# EAGLE design pcb (EAGLE 6.4)
CHECKED: ctstoner; COMPANY: Michigan Technological Univ.; DATE: 4/20/2013; DRAWN: mjbeals; DRGNO: 1; REV: A
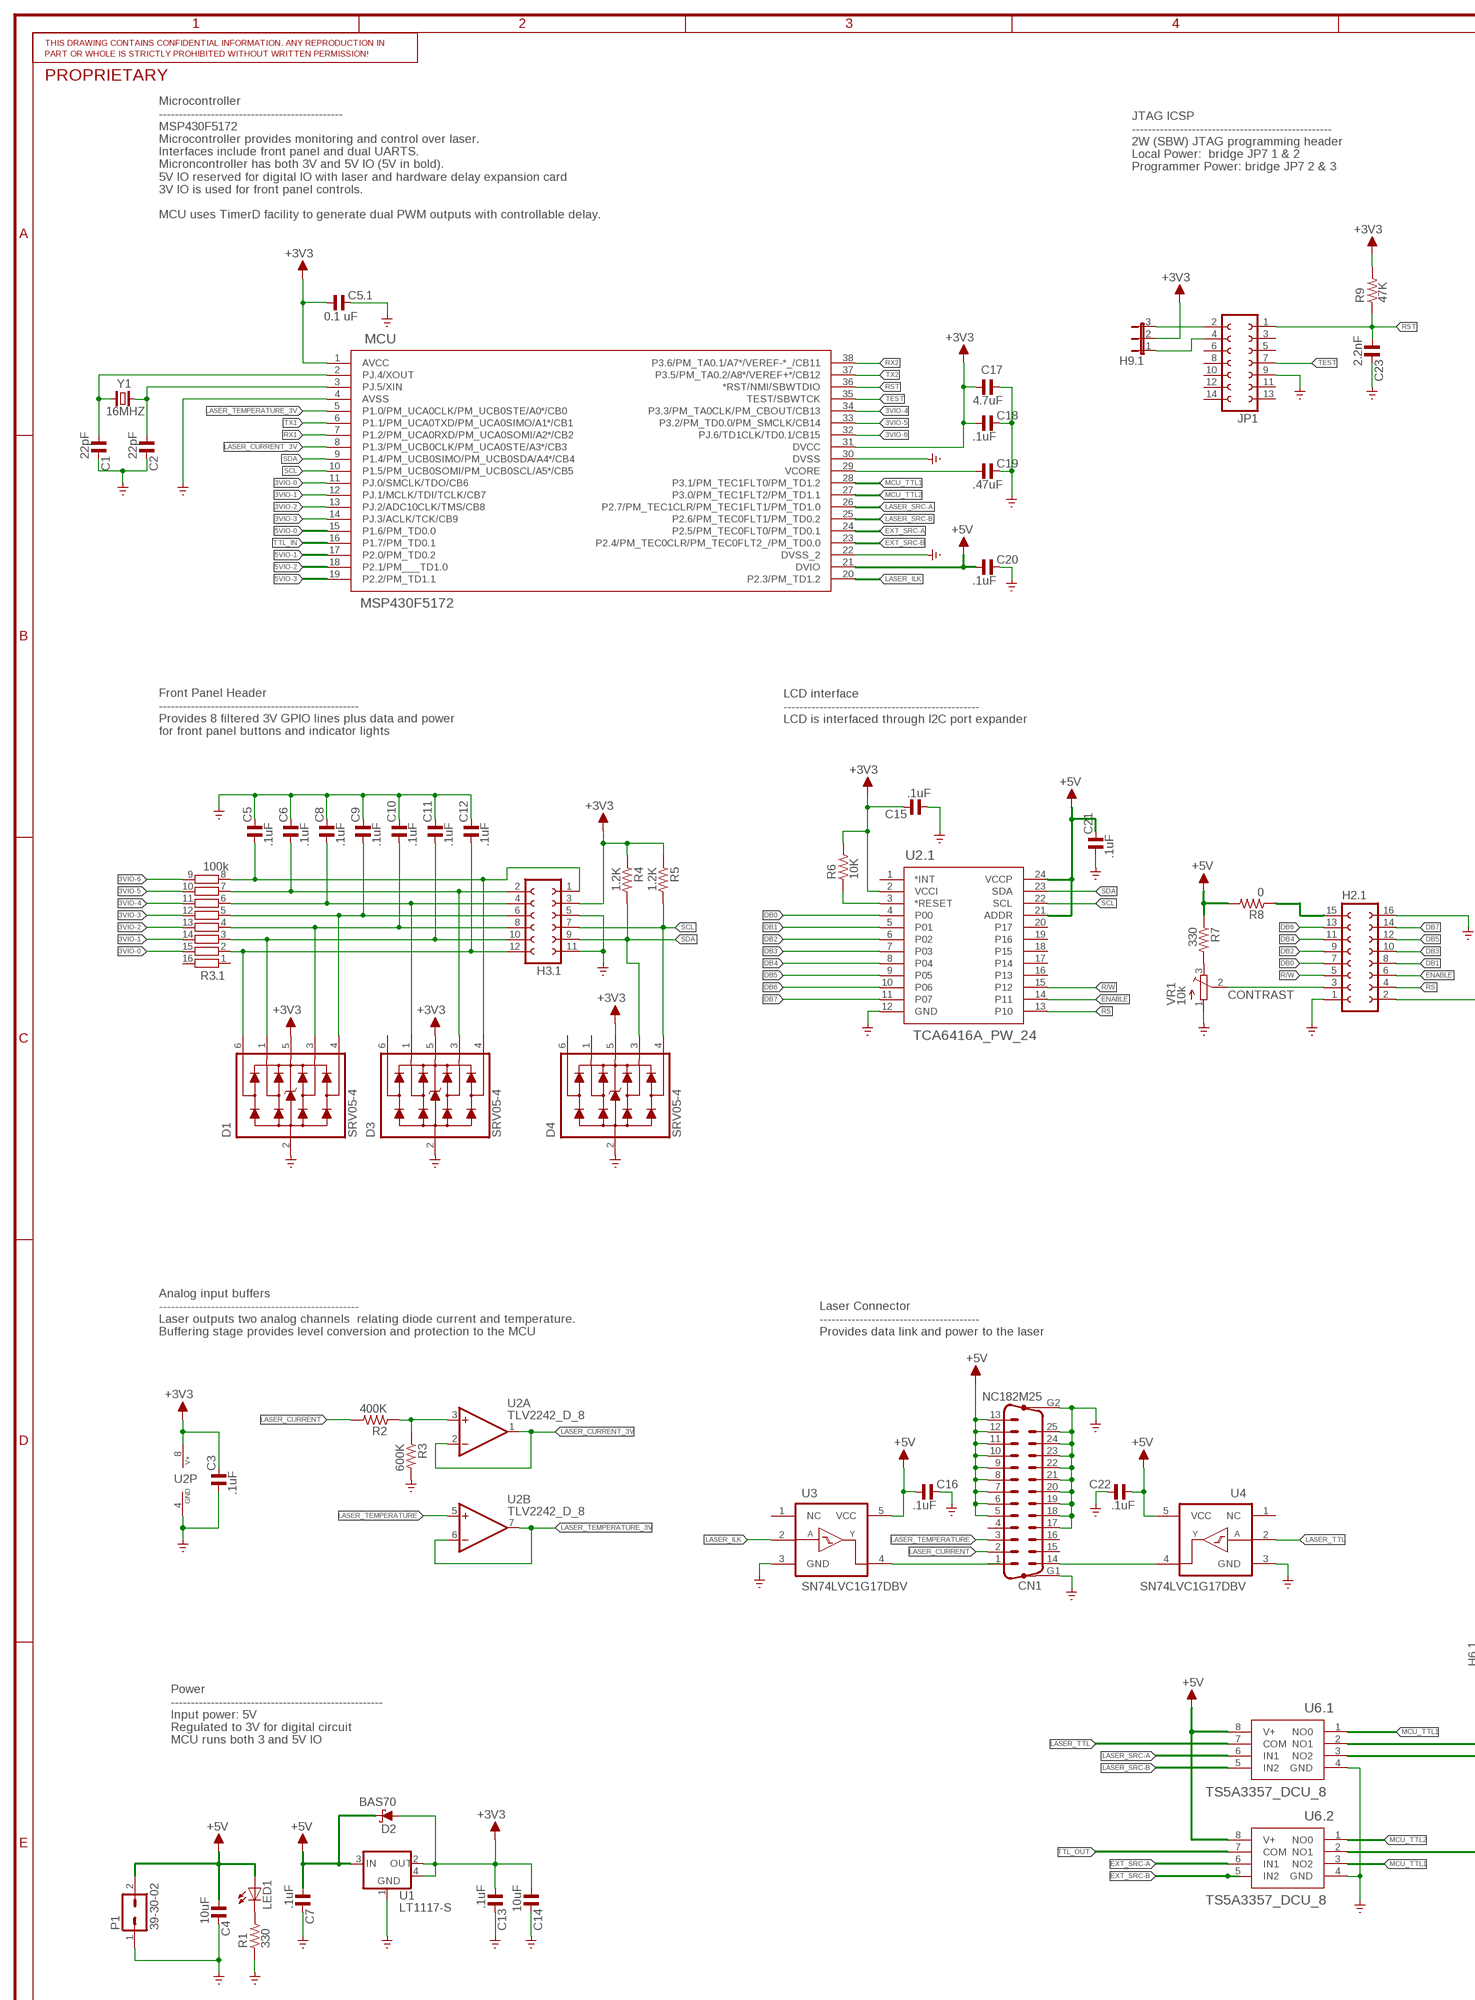
[diagram p0: schematic, sheet 1, part 1 of 3]
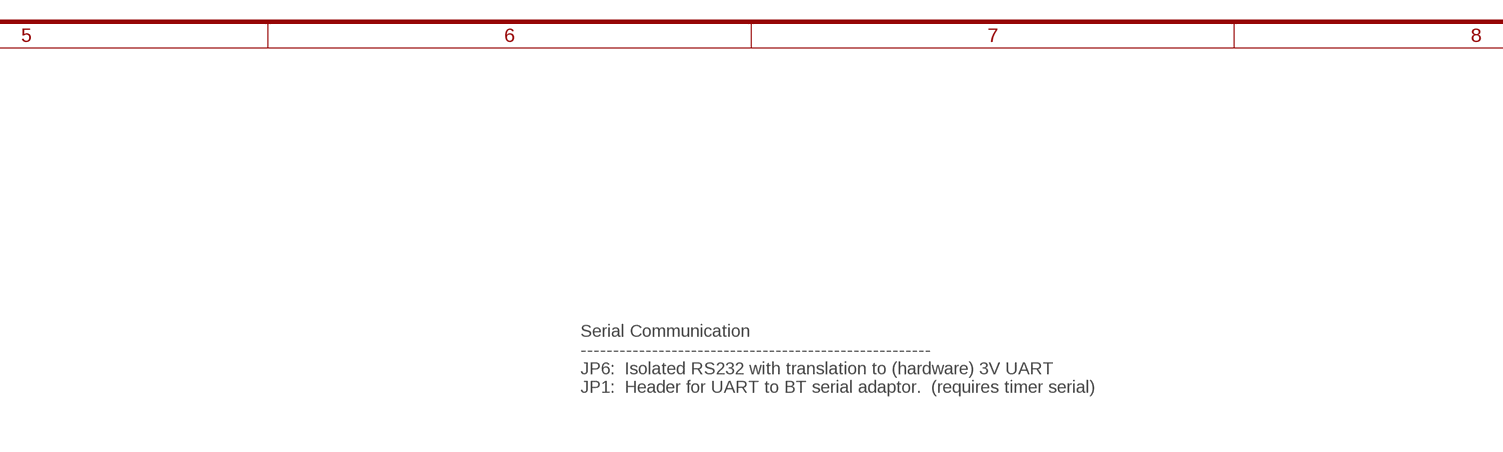
[diagram p1: schematic, sheet 1, part 2 of 3]
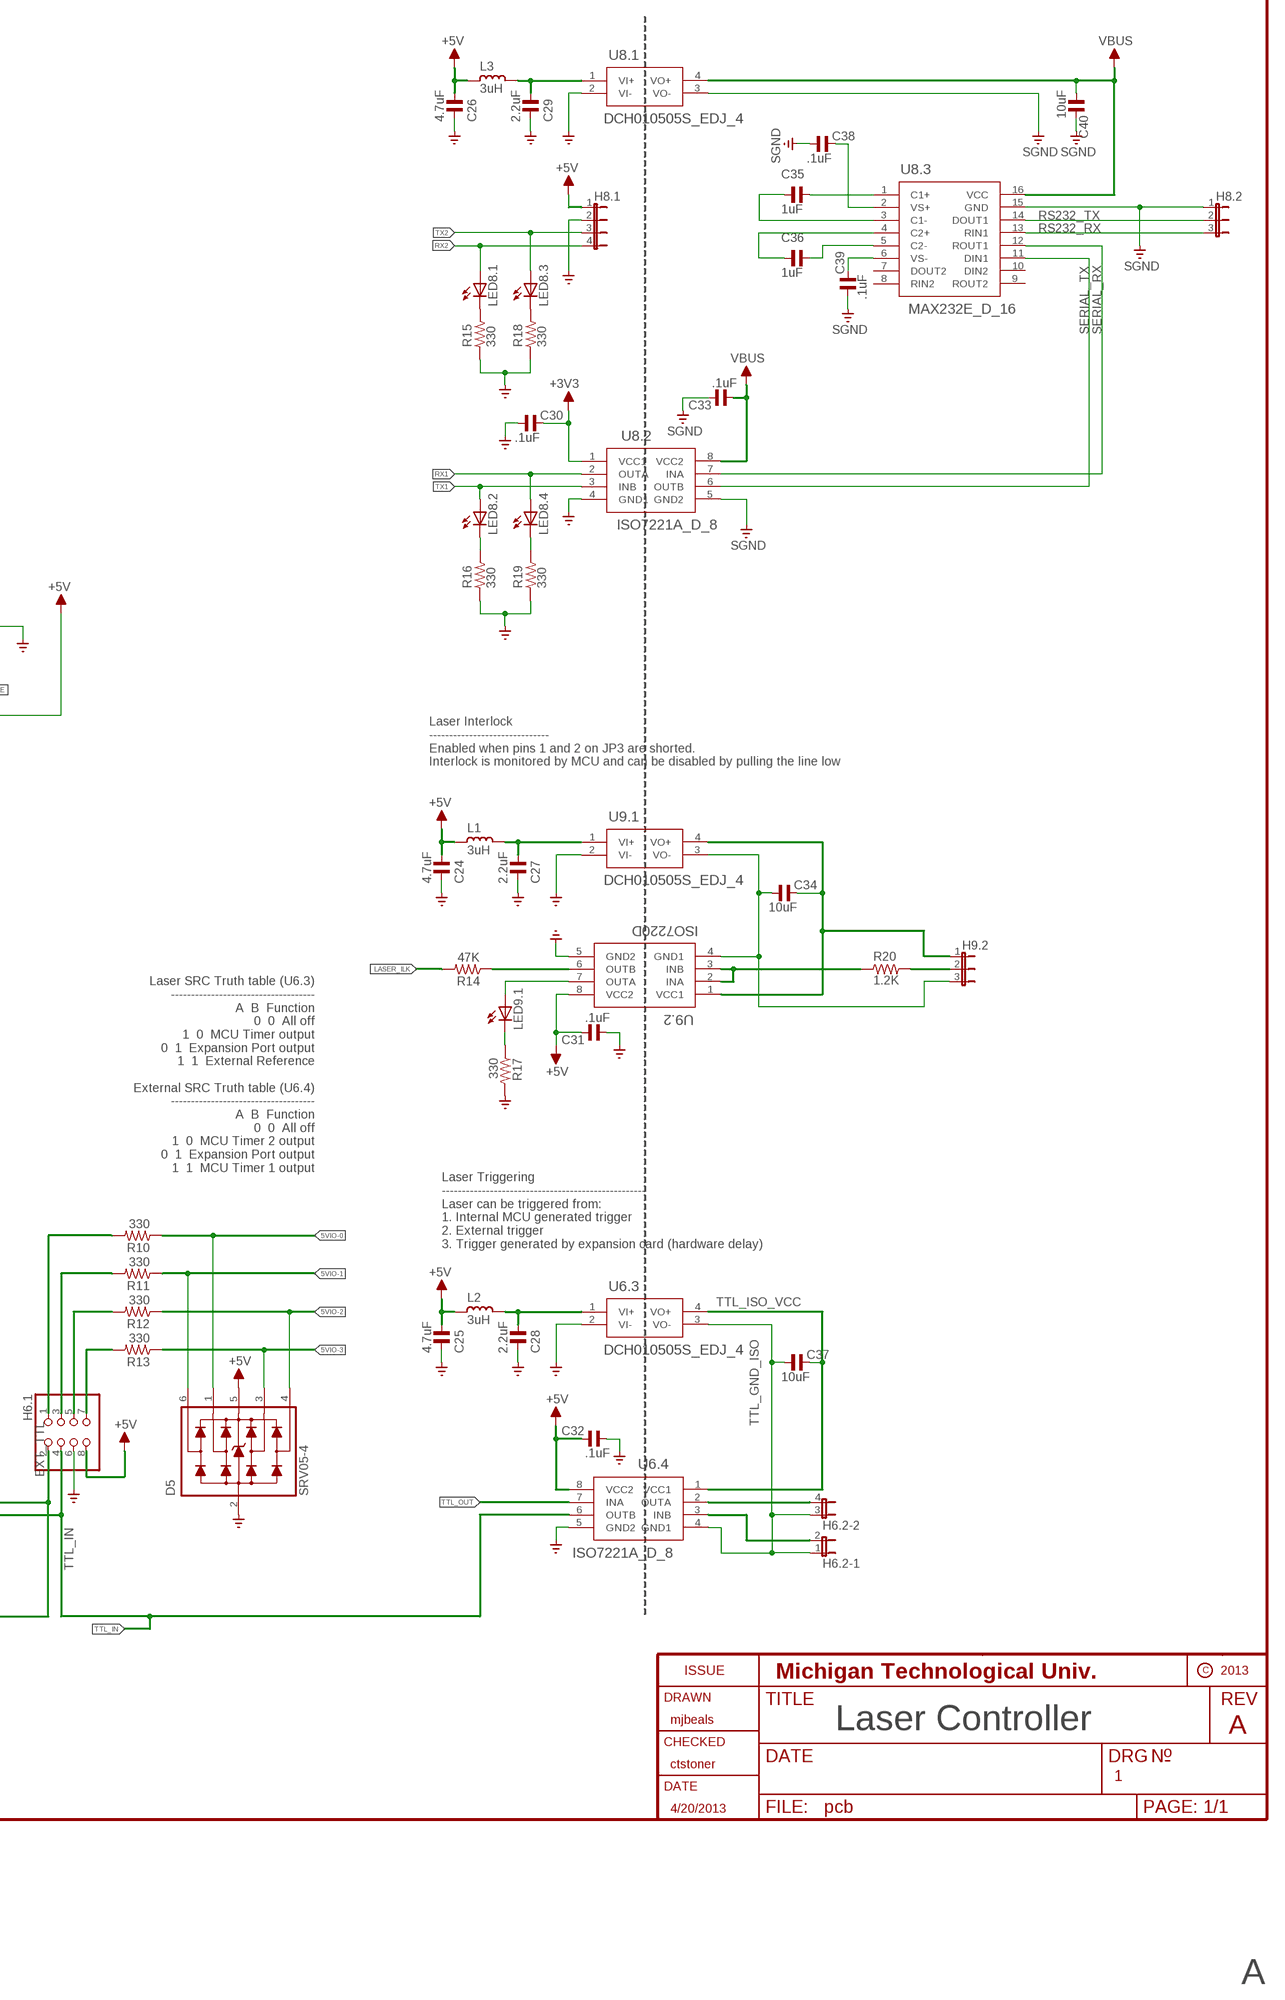
[diagram p2: schematic, sheet 1, part 3 of 3]

## Parts
C1  22pF  C_0603  [C0603]
C2  22pF  C_0603  [C0603]
C3  .1uF  C_0603  [C0603]
C4  10uF  C_0603  [C0603]
C5  .1uF  C_0603  [C0603]
C5.1  0.1 uF  C_0603  [C0603]
C6  .1uF  C_0603  [C0603]
C7  .1uF  C_0603  [C0603]
C8  .1uF  C_0603  [C0603]
C9  .1uF  C_0603  [C0603]
C10  .1uF  C_0603  [C0603]
C11  .1uF  C_0603  [C0603]
C12  .1uF  C_0603  [C0603]
C13  .1uF  C_0603  [C0603]
C14  10uF  C_0603  [C0603]
C15  .1uF  C_0603  [C0603]
C16  .1uF  C_0603  [C0603]
C17  4.7uF  C_0603  [C0603]
C18  .1uF  C_0603  [C0603]
C19  .47uF  C_0603  [C0603]
C20  .1uF  C_0603  [C0603]
C21  .1uF  C_0603  [C0603]
C22  .1uF  C_0603  [C0603]
C23  2.2nF  C_0603  [C0603]
C24  4.7uF  C_0603  [C0603]
C25  4.7uF  C_0603  [C0603]
C26  4.7uF  C_0603  [C0603]
C27  2.2uF  C_0603  [C0603]
C28  2.2uF  C_0603  [C0603]
C29  2.2uF  C_0603  [C0603]
C30  .1uF  C_0603  [C0603]
C31  .1uF  C_0603  [C0603]
C32  .1uF  C_0603  [C0603]
C33  .1uF  C_0603  [C0603]
C34  10uF  C_0603  [C0603]
C35  1uF  C_0603  [C0603]
C36  1uF  C_0603  [C0603]
C37  10uF  C_0603  [C0603]
C38  .1uF  C_0603  [C0603]
C39  .1uF  C_0603  [C0603]
C40  10uF  C_0603  [C0603]
CN1  NC182M25  [NC182M25]
D1  SRV05-4  [SOT23-6L]
D2  BAS70  [SOT23]
D3  SRV05-4  [SOT23-6L]
D4  SRV05-4  [SOT23-6L]
D5  SRV05-4  [SOT23-6L]
H2.1  FE08-2  [FE08-2]
H3.1  FE06-2  [FE06-2]
H6.1  PINHD-2X4  [2X04]
H6.2  JP2QE  [JP2Q]
H8.1  JP4E  [JP4]
H8.2  JP2E  [JP2]
H9.1  JP2E  [JP2]
H9.2  JP2E  [JP2]
JP1  FE07-2  [FE07-2]
L1  3uH  L_0805  [L0805]
L2  3uH  L_0805  [L0805]
L3  3uH  L_0805  [L0805]
LED1  LEDSMT1206  [1206]
LED8.1  LEDSMT1206  [1206]
LED8.2  LEDSMT1206  [1206]
LED8.3  LEDSMT1206  [1206]
LED8.4  LEDSMT1206  [1206]
LED9.1  LEDSMT1206  [1206]
MCU  MSP430F5172  MSP430F5172_DA_38  [DA38]
P1  39-30-02  [39-30-?02?]
R1  330  R_0603  [R0603]
R2  400K  R_0603  [R0603]
R3  600K  R_0603  [R0603]
R3.1  100k  2QSP16-8  [2QSP16]
R4  1.2K  R_0603  [R0603]
R5  1.2K  R_0603  [R0603]
R6  10K  R_0603  [R0603]
R7  330  R_0603  [R0603]
R8  0  R_0603  [R0603]
R9  47K  R_0603  [R0603]
R10  330  R_0603  [R0603]
R11  330  R_0603  [R0603]
R12  330  R_0603  [R0603]
R13  330  R_0603  [R0603]
R14  47K  R_0603  [R0603]
R15  330  R_0603  [R0603]
R16  330  R_0603  [R0603]
R17  330  R_0603  [R0603]
R18  330  R_0603  [R0603]
R19  330  R_0603  [R0603]
R20  1.2K  R_0603  [R0603]
U1  LT1117-S  [SOT223]
U2  TLV2242_D_8  LMV358D  [SO08]
U2.1  TCA6416A_PW_24  [PW24]
U3  SN74LVC1G17DBV  [SOT23-5]
U4  SN74LVC1G17DBV  [SOT23-5]
U6.1  TS5A3357_DCU_8  [DCU8]
U6.2  TS5A3357_DCU_8  [DCU8]
U6.3  DCH010505S_EDJ_4  [EDJ4]
U6.4  ISO7221A_D_8  [D8]
U8.1  DCH010505S_EDJ_4  [EDJ4]
U8.2  ISO7221A_D_8  [D8]
U8.3  MAX232E_D_16  [D16]
U9.1  DCH010505S_EDJ_4  [EDJ4]
U9.2  ISO7220D  ISO7420_D_8  [D8]
VR1  10k  TRIMPOTTC33X  [TC33X]
Y1  16MHZ  CRYTALHC49S  [HC49/S]

## Nets
3VIO-0: MCU.11(PJ.0/SMCLK/TDO/CB6) R3.1.15
3VIO-0H: C5.1 D3.4 H3.1.1 R3.1.8
3VIO-1: MCU.12(PJ.1/MCLK/TDI/TCLK/CB7) R3.1.14
3VIO-1H: C6.1 D3.3 H3.1.2 R3.1.7
3VIO-2: MCU.13(PJ.2/ADC10CLK/TMS/CB8) R3.1.13
3VIO-2H: C8.1 D3.1 H3.1.4 R3.1.6
3VIO-3: MCU.14(PJ.3/ACLK/TCK/CB9) R3.1.12
3VIO-3H: C9.1 D1.4 H3.1.6 R3.1.5
3VIO-4: MCU.34(P3.3/PM_TA0CLK/PM_CBOUT/CB13) R3.1.11
3VIO-4H: C10.1 D1.3 H3.1.8 R3.1.4
3VIO-5: MCU.33(P3.2/PM_TD0.0/PM_SMCLK/CB14) R3.1.10
3VIO-5H: C11.1 D1.1 H3.1.10 R3.1.3
3VIO-6: MCU.32(PJ.6/TD1CLK/TD0.1/CB15) R3.1.9
3VIO-6H: C12.1 D1.6 H3.1.12 R3.1.2
5VIO-0: D5.1 MCU.15(P1.6/PM_TD0.0) R10.1
5VIO-1: D5.6 MCU.17(P2.0/PM_TD0.2) R11.1
5VIO-2: D5.4 MCU.18(P2.1/PM___TD1.0) R12.1
5VIO-3: D5.3 MCU.19(P2.2/PM_TD1.1) R13.1
+3V3: C3.2 C5.1.1 C13.1 C14.1 C15.2 C17.1 C18.1 C30.2 D1.5 D2.1(A) D3.5 D4.5 H3.1.3 H9.1.2 MCU.1(AVCC) MCU.31(DVCC) R4.1 R5.1 R6.2 R9.2 U1.2(OUT) U1.4(TAB) U2.1.2(VCCI) U2.8(P:V+) U8.2.1(VCC1)
+5V: C4.1 C7.1 C16.1 C20.1 C21.2 C22.1 C24.1 C25.1 C26.1 C31.2 C32.2 CN1.5 CN1.6 CN1.7 CN1.8 CN1.9 CN1.10 CN1.11 CN1.12 CN1.13 D2.3(C) D5.5 H2.1.2 H6.1.8 H8.1.1 L1.2 L2.2 L3.2 LED1.A MCU.21(DVIO) P1.2 R7.1 R8.2 U1.3(IN) U2.1.21(ADDR) U2.1.24(VCCP) U3.5(VCC) U4.5(VCC) U6.1.8(V+) U6.2.8(V+) U6.4.8(VCC2) U9.2.8(VCC2)
CONTRAST: H2.1.3 VR1.2(S)
DB0: H2.1.7 U2.1.4(P00)
DB1: H2.1.8 U2.1.5(P01)
DB2: H2.1.9 U2.1.6(P02)
DB3: H2.1.10 U2.1.7(P03)
DB4: H2.1.11 U2.1.8(P04)
DB5: H2.1.12 U2.1.9(P05)
DB6: H2.1.13 U2.1.10(P06)
DB7: H2.1.14 U2.1.11(P07)
ENABLE: H2.1.6 U2.1.14(P11)
EXT_SRC-A: MCU.24(P2.5/PM_TEC0FLT0/PM_TD0.1) U6.2.6(IN1)
EXT_SRC-B: MCU.23(P2.4/PM_TEC0CLR/PM_TEC0FLT2_/PM_TD0.0) U6.2.5(IN2)
EXT_TTL: H6.1.2 U6.1.2(NO1) U6.2.2(NO1)
GND: C1.2 C2.2 C3.1 C4.2 C5.1.2 C5.2 C6.2 C7.2 C8.2 C9.2 C10.2 C11.2 C12.2 C13.2 C14.2 C15.1 C16.2 C17.2 C18.2 C19.2 C20.2 C21.1 C22.2 C23.2 C24.2 C25.2 C26.2 C27.2 C28.2 C29.2 C30.1 C31.1 C32.1 CN1.17 CN1.18 CN1.19 CN1.20 CN1.21 CN1.22 CN1.23 CN1.24 CN1.25 CN1.G1 CN1.G2 D1.2 D3.2 D4.2 D5.2 H2.1.1 H2.1.16 H3.1.5 H3.1.11 H6.1.6 H8.1.2 JP1.9 MCU.4(AVSS) MCU.22(DVSS_2) MCU.30(DVSS) P1.1 R1.1 R3.2 R15.1 R16.1 R17.2 R18.1 R19.1 U1.1(GND) U2.1.12(GND) U2.4(P:GND) U3.3(GND) U4.3(GND) U6.1.4(GND) U6.2.4(GND) U6.3.2(VI-) U6.4.5(GND2) U8.1.2(VI-) U8.2.4(GND1) U9.1.2(VI-) U9.2.5(GND2) VR1.1(A)
LASER_CURRENT: CN1.2 R2.2
LASER_CURRENT_3V: MCU.8(P1.3/PM_UCB0CLK/PM_UCA0STE/A3*/CB3) U2.1(A:OUT) U2.2(A:-IN)
LASER_ILK: MCU.20(P2.3/PM_TD1.2) R14.2 U3.2(A)
LASER_ILK_HIGH: R14.1 U9.2.6(OUTB)
LASER_SRC-A: MCU.26(P2.7/PM_TEC1CLR/PM_TEC1FLT1/PM_TD1.0) U6.1.6(IN1)
LASER_SRC-B: MCU.25(P2.6/PM_TEC0FLT1/PM_TD0.2) U6.1.5(IN2)
LASER_TEMPERATURE: CN1.3 U2.5(B:+IN)
LASER_TEMPERATURE_3V: MCU.5(P1.0/PM_UCA0CLK/PM_UCB0STE/A0*/CB0) U2.6(B:-IN) U2.7(B:OUT)
LASER_TTL: U4.2(A) U6.1.7(COM)
MCU_TTL1: MCU.28(P3.1/PM_TEC1FLT0/PM_TD1.2) U6.1.1(NO0) U6.2.3(NO2)
MCU_TTL2: MCU.27(P3.0/PM_TEC1FLT2/PM_TD1.1) U6.2.1(NO0)
N$1: C36.1 U8.3.4(C2+)
N$2: C36.2 U8.3.5(C2-)
N$3: C35.1 U8.3.3(C1-)
N$4: C35.2 U8.3.1(C1+)
N$5: C39.2 U8.3.6(VS-)
N$6: C38.2 U8.3.2(VS+)
N$8: LED9.1.A U9.2.7(OUTA)
N$9: C27.1 L1.1 U9.1.1(VI+)
N$10: CN1.14 U4.4(Y)
N$11: H6.2.2 U6.4.3(INB)
N$12: CN1.1 U3.4(Y)
N$13: H9.1.1 JP1.4
N$14: H9.2.2 R20.2
N$15: R6.1 U2.1.3(*RESET)
N$16: H9.1.3 JP1.2
N$17: H6.1.1 R10.2
N$18: R2.1 R3.1 U2.3(A:+IN)
N$19: R20.1 U9.2.2(INA) U9.2.3(INB)
N$20: LED1.C R1.2
N$21: C1.1 MCU.2(PJ.4/XOUT) Y1.2
N$22: C2.1 MCU.3(PJ.5/XIN) Y1.1
N$23: LED8.2.C R16.2
N$24: C19.1 MCU.29(VCORE)
N$25: LED8.4.C R19.2
N$26: LED8.1.C R15.2
N$27: C34.2 H9.2.1 U9.1.4(VO+) U9.2.1(VCC1)
N$28: C34.1 H9.2.3 U9.1.3(VO-) U9.2.4(GND1)
N$29: LED8.3.C R18.2
N$30: LED9.1.C R17.1
N$31: H6.1.3 R11.2
N$32: C28.1 L2.1 U6.3.1(VI+)
N$33: C29.1 L3.1 U8.1.1(VI+)
N$34: H6.1.5 R12.2
N$35: H6.1.7 R13.2
N$39: R7.2 VR1.3(E)
N$41: H2.1.15 R8.1
R/W: H2.1.5 U2.1.15(P12)
RS: H2.1.4 U2.1.13(P10)
RS232_RX: H8.2.3 U8.3.13(RIN1)
RS232_TX: H8.2.2 U8.3.14(DOUT1)
RST: C23.1 JP1.1 MCU.36(*RST/NMI/SBWTDIO) R9.1
RX1: LED8.4.A MCU.7(P1.2/PM_UCA0RXD/PM_UCA0SOMI/A2*/CB2) U8.2.2(OUTA)
RX2: H8.1.4 LED8.1.A MCU.38(P3.6/PM_TA0.1/A7*/VEREF-*_/CB11)
SCL: D4.4 H3.1.7 MCU.10(P1.5/PM_UCB0SOMI/PM_UCB0SCL/A5*/CB5) R5.2 U2.1.22(SCL)
SDA: D4.3 H3.1.9 MCU.9(P1.4/PM_UCB0SIMO/PM_UCB0SDA/A4*/CB4) R4.2 U2.1.23(SDA)
SERIAL_RX: U8.2.7(INA) U8.3.12(ROUT1)
SERIAL_TX: U8.2.6(OUTB) U8.3.11(DIN1)
SGND: C33.2 C38.1 C39.1 C40.2 H8.2.1 U8.1.3(VO-) U8.2.5(GND2) U8.3.15(GND)
TEST: JP1.7 MCU.35(TEST/SBWTCK)
TTL_GND_ISO: C37.1 H6.2.1 H6.2.3 U6.3.3(VO-) U6.4.4(GND1)
TTL_IN: H6.1.4 MCU.16(P1.7/PM_TD0.1) U6.1.3(NO2) U6.4.6(OUTB)
TTL_ISO_VCC: C37.2 U6.3.4(VO+) U6.4.1(VCC1)
TTL_OUT: U6.2.7(COM) U6.4.7(INA)
TTL_OUT_ISO: H6.2.4 U6.4.2(OUTA)
TX1: LED8.2.A MCU.6(P1.1/PM_UCA0TXD/PM_UCA0SIMO/A1*/CB1) U8.2.3(INB)
TX2: H8.1.3 LED8.3.A MCU.37(P3.5/PM_TA0.2/A8*/VEREF+*/CB12)
VBUS: C33.1 C40.1 U8.1.4(VO+) U8.2.8(VCC2) U8.3.16(VCC)
Unconnected: CN1.4 CN1.15 CN1.16 D3.6 D4.1 D4.6 JP1.3 JP1.5 JP1.6 JP1.8 JP1.10 JP1.11 JP1.12 JP1.13 JP1.14 R3.1.1 R3.1.16 U2.1.1(*INT) U2.1.16(P13) U2.1.17(P14) U2.1.18(P15) U2.1.19(P16) U2.1.20(P17) U3.1(NC) U4.1(NC) U8.3.7(DOUT2) U8.3.8(RIN2) U8.3.9(ROUT2) U8.3.10(DIN2)

## Notes on the sheet
- JTAG ICSP
  --------------------------------------------------
  2W (SBW) JTAG programming header
  Local Power:  bridge JP7 1 & 2
  Programmer Power: bridge JP7 2 & 3
- Microcontroller
  ----------------------------------------------
  MSP430F5172
  Microcontroller provides monitoring and control over laser.
  Interfaces include front panel and dual UARTS.
  Microncontroller has both 3V and 5V IO (5V in bold).
  5V IO reserved for digital IO with laser and hardware delay expansion card
  3V IO is used for front panel controls.
  
  MCU uses TimerD facility to generate dual PWM outputs with controllable delay.
- Serial Communication
  ------------------------------------------------------
  JP6:  Isolated RS232 with translation to (hardware) 3V UART
  JP1:  Header for UART to BT serial adaptor.  (requires timer serial)
- LCD interface
  -------------------------------------------------
  LCD is interfaced through I2C port expander
- Front Panel Header
  --------------------------------------------------
  Provides 8 filtered 3V GPIO lines plus data and power 
  for front panel buttons and indicator lights
- Laser Interlock
  ------------------------------
  Enabled when pins 1 and 2 on JP3 are shorted.
  Interlock is monitored by MCU and can be disabled by pulling the line low
- Analog input buffers
  --------------------------------------------------
  Laser outputs two analog channels  relating diode current and temperature.
  Buffering stage provides level conversion and protection to the MCU
- Laser Connector
  ----------------------------------------
  Provides data link and power to the laser
- Laser SRC Truth table (U6.3)
  ------------------------------------
  A  B  Function
  0  0  All off
  1  0  MCU Timer output
  0  1  Expansion Port output
  1  1  External Reference
  
  External SRC Truth table (U6.4)
  ------------------------------------
  A  B  Function
  0  0  All off
  1  0  MCU Timer 2 output
  0  1  Expansion Port output
  1  1  MCU Timer 1 output
- Laser Triggering
  ---------------------------------------------------
  Laser can be triggered from:
  1. Internal MCU generated trigger
  2. External trigger
  3. Trigger generated by expansion card (hardware delay)
- Power
  -----------------------------------------------------
  Input power: 5V
  Regulated to 3V for digital circuit
  MCU runs both 3 and 5V IO
- Laser Controller
- A

## Library data of the parts
C1-C5 C5.1 C6-C40 = rc-master-smd:C_: NON-POLARIZED CAP
CN1 = custom:NC182M25: DB25 Male
D1 D3-D5 = diode:SRV05-4: TVS Diode Array RailClamp® Low-Capacitance
D2 = diode:BAS70: Silicon Schottky Diodes General-purpose diode for high-speed switching
H2.1 = con-lsta:FE08-2: FEMALE HEADER; OC_FARNELL: unknown; OC_NEWARK: unknown
H3.1 = con-lsta:FE06-2: FEMALE HEADER; OC_FARNELL: unknown; OC_NEWARK: unknown
H6.1 = adafruit:PINHD-2X4: PIN HEADER
H6.2 = jumper:JP2QE: JUMPER
H8.1 = jumper:JP4E: JUMPER
H8.2 H9.1 H9.2 = jumper:JP2E: JUMPER
JP1 = con-lsta:FE07-2: FEMALE HEADER; OC_FARNELL: unknown; OC_NEWARK: unknown
L1-L3 = rc-master-smd:L_: INDUCTOR
LED1 LED8.1-LED8.4 LED9.1 = led:LED: LED OSRAM: - CHIPLED LG R971, LG N971, LY N971, LG Q971, LY Q971, LO R971, LY R971 LH N974, LH R974 LS Q976, LO Q976, LY Q976 LO Q996 - Hyper CHIPLED LW Q18S LB Q993, LB Q99A, LB R99A - SideLED LS A670, LO A670, LY A670, LG A670, LP A670 LB A673, LV A673, LT A673, LW A673 LH A674 LY A675 LS A676, LA A676, LO A676, LY A676, LW A676 LS A679, LY A679, LG A679 - Hyper Micro SIDELED® LS Y876, LA Y876, LO Y876, LY Y876 LT Y87S - SmartLED LW L88C, LW L88S LB L89C, LB L89S, LG L890 LS L89K, LO L89K, LY L89K LS L896, LA L896, LO L896, LY L896 - TOPLED LS T670, LO T670, LY T670, LG T670, LP T670 LSG T670, LSP T670, LSY T670, LOP T670, LYG T670 LG T671, LOG T671, LSG T671 LB T673, LV T673, LT T673, LW T673 LH T674 LS T676, LA T676, LO T676, LY T676, LB T676, LH T676, LSB T676, LW T676 LB T67C, LV T67C, LT T67C, LS T67K, LO T67K, LY T67K, LW E67C LS E67B, LA E67B, LO E67B, LY E67B, LB E67C, LV E67C, LT E67C LW T67C LS T679, LY T679, LG T679 LS T770, LO T770, LY T770, LG T770, LP T770 LB T773, LV T773, LT T773, LW T773 LH T774 LS E675, LA E675, LY E675, LS T675 LS T776, LA T776, LO T776, LY T776, LB T776 LHGB T686 LT T68C, LB T68C - Hyper Mini TOPLED® LB M676 - Mini TOPLED Santana® LG M470 LS M47K, LO M47K, LY M47K Source: http://www.osram.convergy.de LUXEON: - LUMILED® LXK2-PW12-R00, LXK2-PW12-S00, LXK2-PW14-U00, LXK2-PW14-V00 LXK2-PM12-R00, LXK2-PM12-S00, LXK2-PM14-U00 LXK2-PE12-Q00, LXK2-PE12-R00, LXK2-PE12-S00, LXK2-PE14-T00, LXK2-PE14-U00 LXK2-PB12-K00, LXK2-PB12-L00, LXK2-PB12-M00, LXK2-PB14-N00, LXK2-PB14-P00, LXK2-PB14-Q00 LXK2-PR12-L00, LXK2-PR12-M00, LXK2-PR14-Q00, LXK2-PR14-R00 LXK2-PD12-Q00, LXK2-PD12-R00, LXK2-PD12-S00 LXK2-PH12-R00, LXK2-PH12-S00 LXK2-PL12-P00, LXK2-PL12-Q00, LXK2-PL12-R00 Source: www.luxeon.com KINGBRIGHT: KA-3528ASYC Source: www.kingbright.com
MCU = TI:MSP430F5172_DA_38; DATASHEETURL: http://www.ti.com/lit/gpn/MSP430F5172; DESCRIPTION: MSP430F51x2 Mixed Signal Microcontroller; FAMILY_NAME: 5 Series; GENERIC_PART_NUMBER: MSP430F5172; INDUSTRY_STD_PKG_TYPE: TSSOP; MANUFACTURER: Texas Instruments; MANUFACTURER_PART_NUMBER: msp430f5172_da_38; PACKAGE_DESIGNATOR: DA; PIN_COUNT: 38; VENDOR: Texas Instruments
P1 = con-molex-mini-fit:39-30-?02?: HEADER
R1-R20 = rc-master-smd:R_: RESISTOR
R3.1 = resistor-bourns:2QSP16-8: BOURNS RESISTOR NETWORK; OC_FARNELL: unknown; OC_NEWARK: unknown
U1 = v-reg:LT1117: 800mA LDO Positive Regulator Fixed 2.85V, 3.3V, 5V
U2 = op-amp:LMV358: OP-AMP - Dual Operational Amplifier
U2.1 = TI:TCA6416A_PW_24; DATASHEETURL: http://www.ti.com/lit/gpn/TCA6416A; DESCRIPTION: Low-Voltage 16-Bit I2C and SMBus I/O Expander; FAMILY_NAME: I2C IO EXPANDER; GENERIC_PART_NUMBER: TCA6416A; INDUSTRY_STD_PKG_TYPE: TSSOP; MANUFACTURER: Texas Instruments; MANUFACTURER_PART_NUMBER: tca6416a_pw_24; PACKAGE_DESIGNATOR: PW; PIN_COUNT: 24; VENDOR: Texas Instruments
U3 U4 = 74LV:SN74LVC1G17: SINGLE SCHMITT-TRIGGER BUFFER
U6.1 U6.2 = TI:TS5A3357_DCU_8; DATASHEETURL: http://www.ti.com/lit/gpn/TS5A3357; DESCRIPTION: Single 5-Ohm SP3T Analog Switch 5-V/3.3-V 3:1 Analog Multiplexer/Demultiplexer; FAMILY_NAME: ANALOG SWITCH OR MULTIPLEXER (less than or equal to 5V); GENERIC_PART_NUMBER: TS5A3357; INDUSTRY_STD_PKG_TYPE: US8; MANUFACTURER: Texas Instruments; MANUFACTURER_PART_NUMBER: ts5a3357_dcu_8; PACKAGE_DESIGNATOR: DCU; PIN_COUNT: 8; VENDOR: Texas Instruments
U6.3 U8.1 U9.1 = TI:DCH010505S_EDJ_4; DATASHEETURL: http://www.ti.com/lit/gpn/DCH010505S; DESCRIPTION: Miniature, 1W, 3kVDC Isolated DC/DC Converters; FAMILY_NAME: 1 W AND 2 W MINIATURE; GENERIC_PART_NUMBER: DCH010505S; INDUSTRY_STD_PKG_TYPE: SIP MODULE; MANUFACTURER: Texas Instruments; MANUFACTURER_PART_NUMBER: dch010505s_edj_4; PACKAGE_DESIGNATOR: EDJ; PIN_COUNT: 4; VENDOR: Texas Instruments
U6.4 U8.2 = TI:ISO7221A_D_8; DATASHEETURL: http://www.ti.com/lit/gpn/ISO7221A; DESCRIPTION: Dual Channel, 1/1, 1Mbps Digital Isolator; FAMILY_NAME: ISOLATOR; GENERIC_PART_NUMBER: ISO7221A; INDUSTRY_STD_PKG_TYPE: SOIC; MANUFACTURER: Texas Instruments; MANUFACTURER_PART_NUMBER: iso7221a_d_8; PACKAGE_DESIGNATOR: D; PIN_COUNT: 8; VENDOR: Texas Instruments
U8.3 = TI:MAX232E_D_16; DATASHEETURL: http://www.ti.com/lit/gpn/MAX232E; DESCRIPTION: Dual RS-232 Driver/Receiver with IEC61000-4-2 Protection; FAMILY_NAME: RS-232; GENERIC_PART_NUMBER: MAX232E; INDUSTRY_STD_PKG_TYPE: SOIC; MANUFACTURER: Texas Instruments; MANUFACTURER_PART_NUMBER: max232e_d_16; PACKAGE_DESIGNATOR: D; PIN_COUNT: 16; VENDOR: Texas Instruments
U9.2 = TI:ISO7420_D_8; DATASHEETURL: http://www.ti.com/lit/gpn/ISO7420; DESCRIPTION: Low Power Dual Channel Isolators; FAMILY_NAME: ISOLATOR; GENERIC_PART_NUMBER: ISO7420; INDUSTRY_STD_PKG_TYPE: SOIC; MANUFACTURER: Texas Instruments; MANUFACTURER_PART_NUMBER: iso7420_d_8; PACKAGE_DESIGNATOR: D; PIN_COUNT: 8; VENDOR: Texas Instruments
VR1 = adafruit:TRIMPOT: SMT trimmer potentiometer part number TC33X http://www.ladyada.net/library/eagle
Y1 = crystal:CRYTAL: CRYSTAL

## Net classes
0 default: width 0.254 mm, drill 0.508 mm, clearance 0.152 mm

## Board
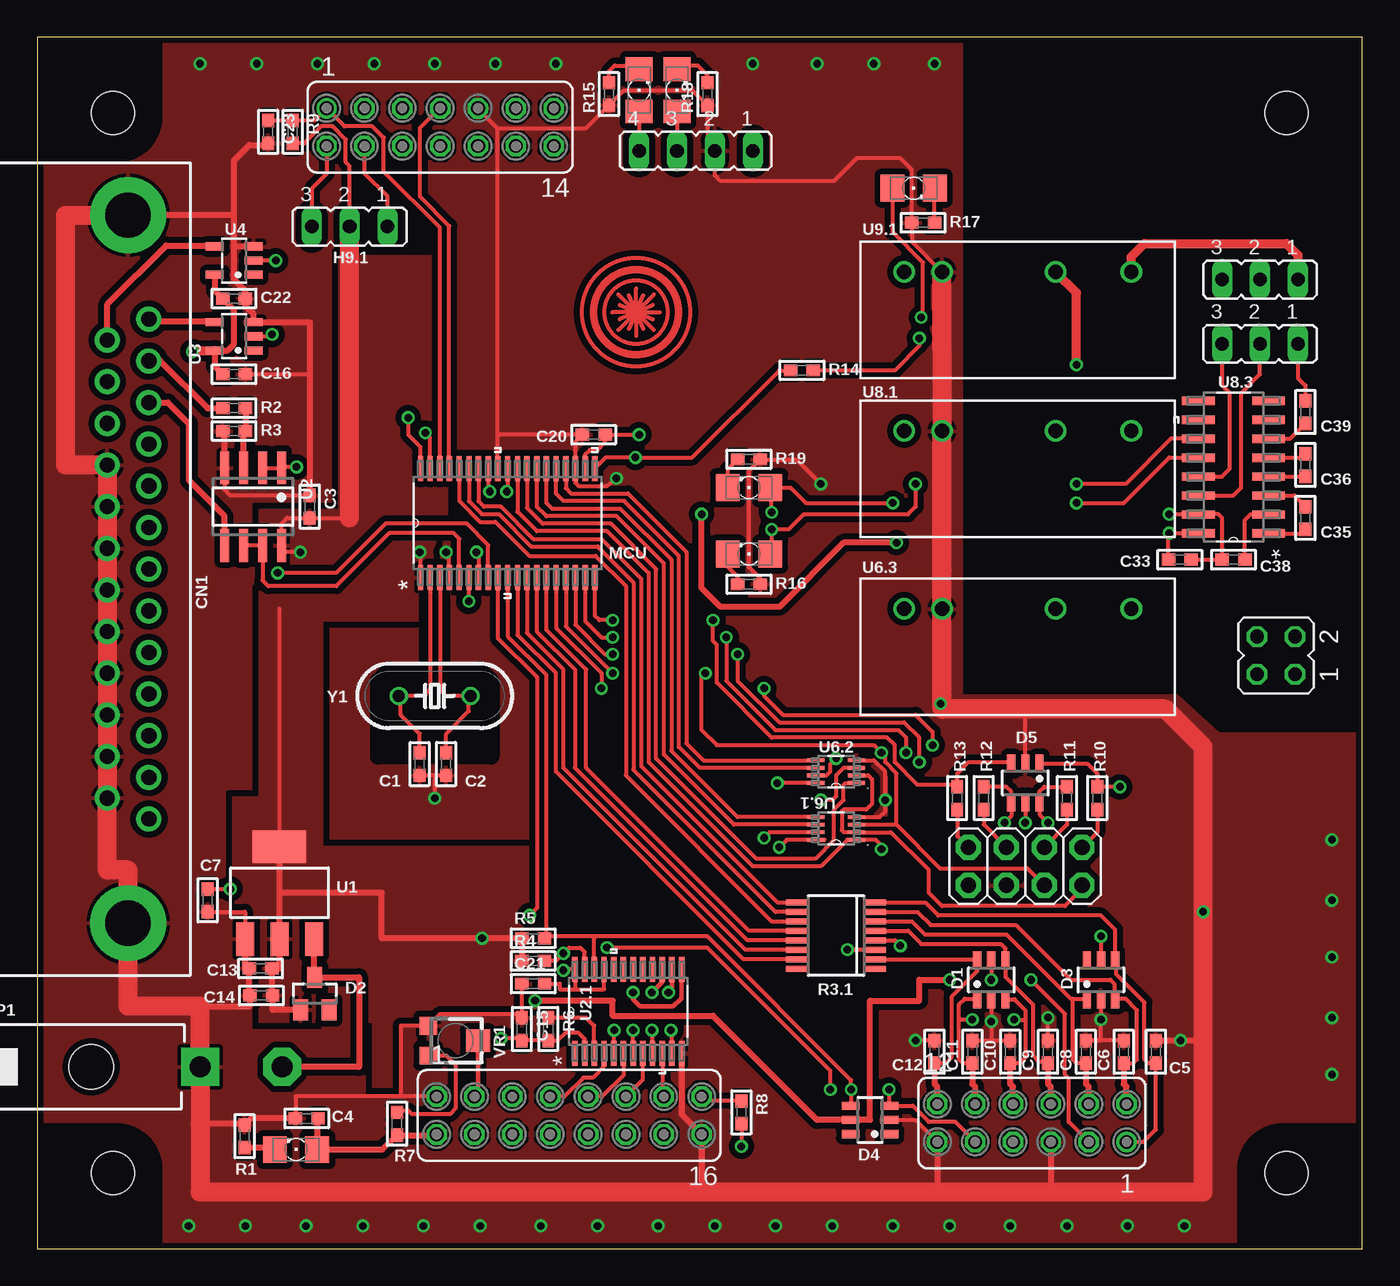
[diagram p3: board, top side]
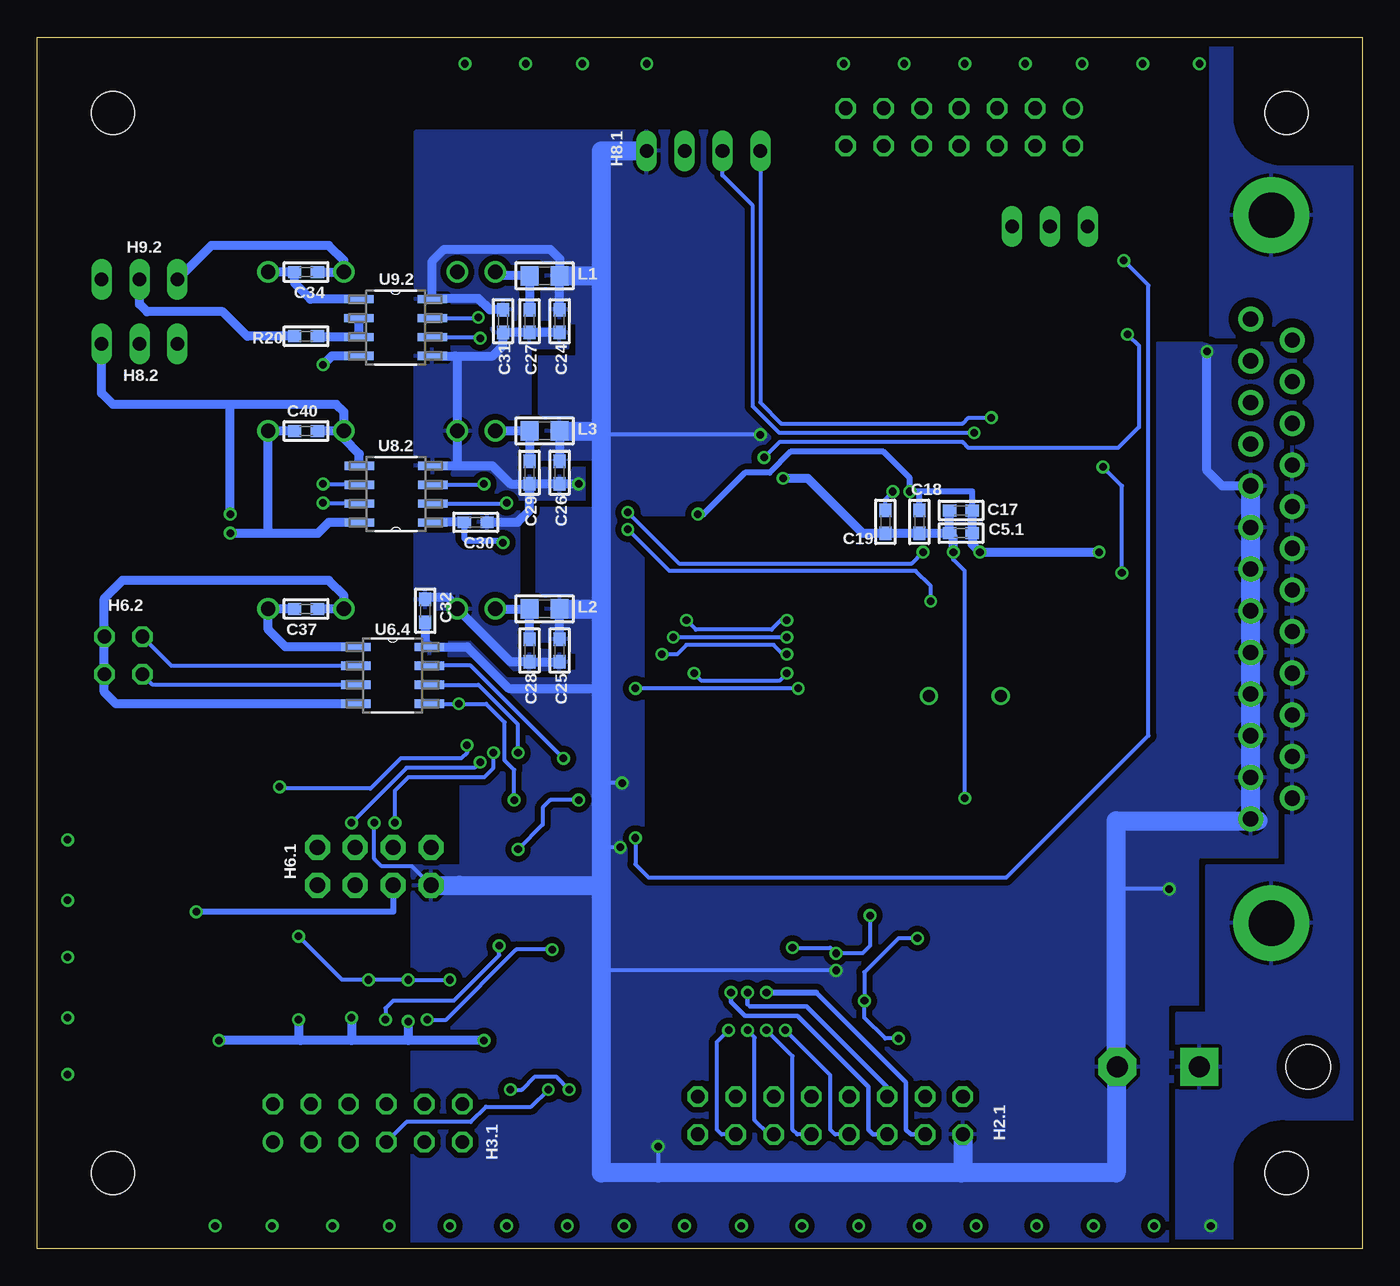
[diagram p4: board, bottom side, seen from below]

Size 88.9 x 81.28 mm. Coordinates in mm from the lower left corner, seen from the top.
Outline: 0,81.28 0,0 88.9,0 88.9,81.28 0,81.28
Copper layers (1*16): Top 0.0356mm / dielectric 1.5011mm / Bottom 0.0356mm
Design rules "LaenPCBOrder *": minimum track width 10mil, minimum drill 13mil, track to track 6mil, track to pad 6mil, pad to pad 6mil, via to via 6mil, smd to smd 6mil, copper to edge 15mil, drill to drill 6mil, minimum pad ring 7mil, minimum via ring 7mil, stop-mask expansion 4mil, vias tented up to drill 24mil, thermal gap 10mil
Holes 2.87 mm at 83.82,76.2 83.82,5.08 5.08,5.08 5.08,76.2
tRestrict: area 22.9,33 to 30.5,45.7; area 81,0 to 88.9,7.9; area 0,0 to 7.9,7.9; area 81,73.4 to 88.9,81.3; area 0,73.4 to 7.9,81.3
bRestrict: area 0,0 to 7.9,7.9; area 81,0 to 88.9,7.9; area 0,73.4 to 7.9,81.3; area 81,73.4 to 88.9,81.3

### Footprints (pad centres in the part's own frame; a part is rotated, then mirrored left to right if it is on the bottom)
C0603 = smd 0.9 x 0.8: 1 -0.762,0; 2 0.762,0
NC182M25 = drill 1.016 pad 1.676: 1 16.891,-2.667; 2 14.097,-2.667; 3 11.303,-2.667; 4 8.509,-2.667; 5 5.715,-2.667; 6 2.921,-2.667; 7 0.127,-2.667; 8 -2.667,-2.667; 9 -5.461,-2.667; 10 -8.255,-2.667; 11 -11.049,-2.667; 12 -13.843,-2.667; 13 -16.637,-2.667; 14 15.494,0.127; 15 12.7,0.127; 16 9.906,0.127; 17 7.112,0.127; 18 4.318,0.127; 19 1.524,0.127; 20 -1.27,0.127; 21 -4.064,0.127; 22 -6.858,0.127; 23 -9.652,0.127; 24 -12.446,0.127; 25 -15.24,0.127 | drill 3.048 pad 5.08: G1 -23.622,-1.27; G2 23.876,-1.27
SOT23-6L = smd 0.55 x 1.2: 1 -0.95,-1.3; 2 0,-1.3; 3 0.95,-1.3; 4 0.95,1.3; 5 0,1.3; 6 -0.95,1.3
SOT23 = smd 1 x 1.4: 1 -0.95,-1.1; 2 0.95,-1.1; 3 0,1.1
FE08-2 = drill 0.914 octagon: 1 -8.89,1.27; 2 -8.89,-1.27; 3 -6.35,1.27; 4 -6.35,-1.27; 5 -3.81,1.27; 6 -3.81,-1.27; 7 -1.27,1.27; 8 -1.27,-1.27; 9 1.27,1.27; 10 1.27,-1.27; 11 3.81,1.27; 12 3.81,-1.27; 13 6.35,1.27; 14 6.35,-1.27; 15 8.89,1.27; 16 8.89,-1.27
FE06-2 = drill 0.914: 1 -6.35,1.27 | drill 0.914 octagon: 2 -6.35,-1.27; 3 -3.81,1.27; 4 -3.81,-1.27; 5 -1.27,1.27; 6 -1.27,-1.27; 7 1.27,1.27; 8 1.27,-1.27; 9 3.81,1.27; 10 3.81,-1.27; 11 6.35,1.27; 12 6.35,-1.27
2X04 = drill 1.016 pad 1.676 octagon: 1 -3.81,-1.27; 2 -3.81,1.27; 3 -1.27,-1.27; 4 -1.27,1.27; 5 1.27,-1.27; 6 1.27,1.27; 7 3.81,-1.27; 8 3.81,1.27
JP2Q = drill 0.914 octagon: 1 -1.27,-1.27; 2 -1.27,1.27; 3 1.27,-1.27; 4 1.27,1.27
JP4 = drill 0.914 long: 1 -3.81,0; 2 -1.27,0; 3 1.27,0; 4 3.81,0
JP2 = drill 0.914 long: 1 -2.54,0; 2 0,0; 3 2.54,0
FE07-2 = drill 0.914: 1 -7.62,1.27 | drill 0.914 octagon: 2 -7.62,-1.27; 3 -5.08,1.27; 4 -5.08,-1.27; 5 -2.54,1.27; 6 -2.54,-1.27; 7 0,1.27; 8 0,-1.27; 9 2.54,1.27; 10 2.54,-1.27; 11 5.08,1.27; 12 5.08,-1.27; 13 7.62,1.27; 14 7.62,-1.27
L0805 = smd 1.2 x 1.3: 1 -1.016,0; 2 1.016,0
1206 = smd 1.6 x 1.803: A -1.422,0; C 1.422,0
DA38 = smd 1.676 x 0.356: 1 -3.658,5.842; 2 -3.658,5.207; 3 -3.658,4.547; 4 -3.658,3.912; 5 -3.658,3.251; 6 -3.658,2.591; 7 -3.658,1.956; 8 -3.658,1.295; 9 -3.658,0.66; 10 -3.658,0; 11 -3.658,-0.66; 12 -3.658,-1.295; 13 -3.658,-1.956; 14 -3.658,-2.591; 15 -3.658,-3.251; 16 -3.658,-3.912; 17 -3.658,-4.547; 18 -3.658,-5.207; 19 -3.658,-5.842; 20 3.658,-5.842; 21 3.658,-5.207; 22 3.658,-4.547; 23 3.658,-3.912; 24 3.658,-3.251; 25 3.658,-2.591; 26 3.658,-1.956; 27 3.658,-1.295; 28 3.658,-0.66; 29 3.658,0; 30 3.658,0.66; 31 3.658,1.295; 32 3.658,1.956; 33 3.658,2.591; 34 3.658,3.251; 35 3.658,3.912; 36 3.658,4.547; 37 3.658,5.207; 38 3.658,5.842
39-30-?02? = drill 1.422 pad 2.54 square: 1 0,0 | drill 1.422 pad 2.54 octagon: 2 0,5.512 | hole 3: 0,-7.3
R0603 = smd 0.9 x 0.8: 1 -0.762,0; 2 0.762,0
2QSP16 = smd 0.4 x 1.5: 1 -2.223,-2.6; 2 -1.588,-2.6; 3 -0.953,-2.6; 4 -0.318,-2.6; 5 0.318,-2.6; 6 0.953,-2.6; 7 1.588,-2.6; 8 2.223,-2.6; 9 2.223,2.6; 10 1.588,2.6; 11 0.953,2.6; 12 0.318,2.6; 13 -0.318,2.6; 14 -0.953,2.6; 15 -1.588,2.6; 16 -2.223,2.6
SOT223 = smd 1.219 x 2.235: 1 -2.311,-3.099; 2 0,-3.099; 3 2.311,-3.099 | smd 3.6 x 2.2: 4 0,3.099
SO08 = smd 0.6 x 2.2: 1 -1.905,-2.6; 2 -0.635,-2.6; 3 0.635,-2.6; 4 1.905,-2.6; 5 1.905,2.6; 6 0.635,2.6; 7 -0.635,2.6; 8 -1.905,2.6
PW24 = smd 1.676 x 0.356: 1 -2.819,3.581; 2 -2.819,2.921; 3 -2.819,2.286; 4 -2.819,1.626; 5 -2.819,0.965; 6 -2.819,0.33; 7 -2.819,-0.33; 8 -2.819,-0.965; 9 -2.819,-1.626; 10 -2.819,-2.286; 11 -2.819,-2.921; 12 -2.819,-3.581; 13 2.819,-3.581; 14 2.819,-2.921; 15 2.819,-2.286; 16 2.819,-1.626; 17 2.819,-0.965; 18 2.819,-0.33; 19 2.819,0.33; 20 2.819,0.965; 21 2.819,1.626; 22 2.819,2.286; 23 2.819,2.921; 24 2.819,3.581
SOT23-5 = smd 0.55 x 1.2: 1 -0.95,-1.3; 2 0,-1.3; 3 0.95,-1.3; 4 0.95,1.3; 5 -0.95,1.3
DCU8 = smd 1.168 x 0.254: 1 -1.372,0.762; 2 -1.372,0.254; 3 -1.372,-0.254; 4 -1.372,-0.762; 5 1.372,-0.762; 6 1.372,-0.254; 7 1.372,0.254; 8 1.372,0.762
EDJ4 = drill 0.965: 1 -15.24,5.08; 2 -12.7,5.08; 3 -5.08,5.08; 4 0,5.08
D8 = smd 1.981 x 0.559: 1 -2.464,1.905; 2 -2.464,0.635; 3 -2.464,-0.635; 4 -2.464,-1.905; 5 2.464,-1.905; 6 2.464,-0.635; 7 2.464,0.635; 8 2.464,1.905
D16 = smd 2.184 x 0.559: 1 -2.362,4.445; 2 -2.362,3.175; 3 -2.362,1.905; 4 -2.362,0.635; 5 -2.362,-0.635; 6 -2.362,-1.905; 7 -2.362,-3.175; 8 -2.362,-4.445; 9 2.362,-4.445; 10 2.362,-3.175; 11 2.362,-1.905; 12 2.362,-0.635; 13 2.362,0.635; 14 2.362,1.905; 15 2.362,3.175; 16 2.362,4.445
TC33X = smd 1.2 x 1.2: 1 -1,-1.825; 3 1,-1.825 | smd 1.5 x 1.6: 2 0,1.5
HC49/S = drill 0.813: 1 -2.413,0; 2 2.413,0

### Placement (x,y rotation side)
C1  25.65,32.51 270 top
C2  27.43,32.51 270 top
C3  18.29,49.78 270 top
C4  18.08,8.73 180 top
C5  75.06,13.21 90 top
C5.1  26.92,48.01 180 bottom
C6  72.9,13.21 90 top
C7  11.43,23.37 270 top
C8  70.36,13.21 90 top
C9  67.82,13.21 90 top
C10  65.28,13.21 90 top
C11  62.74,13.21 90 top
C12  60.2,13.21 90 top
C13  14.99,18.8 180 top
C14  15.03,16.99 180 top
C15  32.51,14.73 270 top
C16  13.21,58.67 0 top
C17  26.92,49.53 180 bottom
C18  29.72,48.77 270 bottom
C19  32,48.77 270 bottom
C20  37.34,54.61 180 top
C21  33.27,17.78 0 top
C22  13.21,63.75 0 top
C23  15.49,74.93 270 top
C24  53.85,62.23 270 bottom
C25  53.85,40.13 270 bottom
C26  53.85,52.07 270 bottom
C27  55.88,62.23 270 bottom
C28  55.88,40.13 270 bottom
C29  55.88,52.07 270 bottom
C30  59.48,48.74 180 bottom
C31  57.66,62.23 90 bottom
C32  62.87,42.8 270 bottom
C33  76.66,46.23 0 top
C34  70.87,65.53 180 bottom
C35  85.09,49.02 270 top
C36  85.09,52.58 90 top
C37  70.87,42.93 180 bottom
C38  80.26,46.23 0 top
C39  85.09,56.13 270 top
C40  70.87,54.86 0 bottom
CN1  4.83,45.47 90 top
D1  64.01,18.03 0 top
D2  18.62,17.11 0 top
D3  71.37,18.03 0 top
D4  55.88,8.64 90 top
D5  66.29,31.24 180 top
H2.1  35.69,8.94 0 top
H3.1  66.74,8.43 180 top
H6.1  66.29,25.65 180 top
H6.2  83.12,39.8 90 top
H8.1  44.2,73.66 180 top
H8.2  82.04,60.71 180 top
H9.1  20.95,68.58 180 top
H9.2  82.04,65.02 180 top
JP1  27.03,75.25 0 top
L1  54.86,65.28 0 bottom
L2  54.86,42.93 0 bottom
L3  54.86,54.86 0 bottom
LED1  17.37,6.65 180 top
LED8.1  40.39,77.72 90 top
LED8.2  47.75,46.61 180 top
LED8.3  42.93,77.72 90 top
LED8.4  47.75,51.05 180 top
LED9.1  58.8,71.15 0 top
MCU  31.56,48.69 90 top
P1  39-30-02?  [39-30-?02?]  10.92,12.19 270 top
R1  13.91,7.54 270 top
R2  13.21,56.39 180 top
R3  13.21,54.86 180 top
R3.1  53.59,21 90 top
R4  33.27,19.3 0 top
R5  33.27,20.83 0 top
R6  34.29,14.73 270 top
R7  24.13,8.38 90 top
R8  47.24,9.14 270 top
R9  17.14,74.93 270 top
R10  71.12,30.23 270 top
R11  69.09,30.23 270 top
R12  63.5,30.23 270 top
R13  61.72,30.23 270 top
R14  51.31,58.93 180 top
R15  38.35,77.47 90 top
R16  47.75,44.58 180 top
R17  59.44,68.83 180 top
R18  44.96,77.47 90 top
R19  47.75,52.96 180 top
R20  70.87,61.21 180 bottom
U1  16.26,23.88 0 top
U2  14.48,49.78 180 top
U2.1  39.66,15.92 90 top
U3  13.21,61.21 90 top
U4  13.21,66.29 90 top
U6.1  53.59,28.19 180 top
U6.2  53.59,32 180 top
U6.3  73.41,37.85 0 top
U6.4  65.06,38.46 0 bottom
U8.1  73.41,49.78 0 top
U8.2  64.83,50.62 180 bottom
U8.3  80.26,52.43 180 top
U9.1  73.41,60.45 0 top
U9.2  64.87,61.8 0 bottom
VR1  28.07,13.95 270 top
Y1  26.67,37.08 180 top

### Tracks (layer width: path | path; a pad name or v marks a point on that pad's centre or on a via)
3VIO-0
  Top 0.254: MCU.11 32.22,44.9 | 32.22,44.9 32.19,44.88 | 32.22,44.9 32.22,41.19 34.8,38.61 34.8,32 47.39,19.41 R3.1.15
3VIO-0H
  Top 0.254: R3.1.8 59.58,23.23 60.45,22.35 71.37,22.35 72.32,21.4 D3.4 72.39,19.27 72.39,18.41 74.3,16.51 74.3,12.7 74.55,12.45 C5.1 75.06,8 74.22,7.16 H3.1.1
3VIO-1
  Top 0.254: R3.1.14 47.52,20.05 35.31,32.26 35.31,38.86 32.85,41.31 MCU.12
3VIO-1H
  Top 0.254: R3.1.7 59.07,22.59 59.94,21.72 65.66,21.72 69.34,18.03 72.01,18.03 72.26,17.78 72.26,16.8 D3.3 72.35,16.76 73.03,16.76 73.79,16 73.79,12.7 73.53,12.45 C6.1
  Top 0.406: C6.1 72.9,11.05 73.09,10.86 H3.1.2
3VIO-2
  Top 0.254: MCU.13 33.52,41.41 36.07,38.86 36.07,32.26 47.64,20.68 R3.1.13
3VIO-2H
  Top 0.254: R3.1.6 58.69,21.95 59.56,21.08 65.02,21.08 69.34,16.76 69.47,16.76 | 69.47,16.76 70.39,16.76 D3.1 | C8.1 69.72,12.45 69.47,12.7 69.47,16.76
  Top 0.406: C8.1 70.36,11.05 70.55,10.86 H3.1.4
3VIO-3
  Top 0.254: R3.1.12 47.77,21.32 36.83,32.26 36.83,38.86 34.15,41.54 MCU.14
3VIO-3H
  Top 0.254: C9.1 67.69,12.57 67.18,12.57 66.8,12.95 66.8,16.38 64.96,18.23 D1.4 64.96,20.13 64.64,20.45 59.31,20.45 58.44,21.32 R3.1.5
  Top 0.406: C9.1 67.82,11.05 68.01,10.86 H3.1.6
3VIO-4
  Top 0.254: MCU.34 28.31,50.18 29.72,48.77 30.73,48.77 33.02,46.48 37.47,46.48 39.5,44.45 39.5,31.75 49.28,21.97 50.98,21.97 R3.1.11
3VIO-4H  (via drill 0.51)
  Top 0.254: D1.3 65.56,16.73 66.29,16 66.29,15.24 | 66.29,15.24 66.29,12.83 65.91,12.45 C10.1 | R3.1.4 57.55,20.68 v57.91,20.32 | v65.53,15.37 66.17,15.37 66.29,15.24
  Top 0.406: H3.1.8 65.47,10.86 65.28,11.05 C10.1
  Bottom 0.254: 65.53,9.76 H3.1.8 | v65.53,15.37 65.53,16.13 65.02,16.64 60.96,16.64 57.91,19.68 v57.91,20.32
3VIO-5
  Top 0.254: R3.1.10 49.55,22.59 40.01,32.13 40.01,44.7 37.59,47.12 33.15,47.12 30.99,49.28 29.84,49.28 28.97,50.15 MCU.33
3VIO-5H  (via drill 0.51)
  Top 0.254: C11.1 62.1,12.45 61.85,12.7 61.85,15.49 | 61.85,15.49 61.85,16.38 62.23,16.76 63.03,16.76 D1.1 | R3.1.3 54.37,20.05 v54.36,20.07 | v62.74,15.37 61.98,15.37 61.85,15.49
  Top 0.406: C11.1 62.74,11.05 62.93,10.86 H3.1.10
  Bottom 0.254: v54.36,20.07 56.77,20.07 61.47,15.37 v62.74,15.37
3VIO-6
  Top 0.254: R3.1.9 50.98,23.24 49.66,23.24 40.51,32.38 40.51,44.96 37.85,47.62 33.27,47.62 31.11,49.78 29.97,49.78 29.6,50.15 MCU.32
3VIO-6H
  Top 0.254: R3.1.2 62.98,19.41 D1.6 63.06,18.61 61.34,16.89 61.34,12.83 60.96,12.45 C12.1
  Top 0.406: C12.1 60.2,11.05 60.39,10.86 H3.1.12
5VIO-0  (via drill 0.51)
  Top 0.254: D5.1 70.45,32.54 71.12,31.88 R10.1 v72.64,30.99 | MCU.15 34.81,41.64 37.85,38.61 v37.85,37.59 | v48.77,37.59 48.77,37.08 50.04,35.81 58.93,35.81 60.07,34.67 v60.07,33.78
  Bottom 0.254: v37.85,37.59 v48.77,37.59 | v60.07,33.78 60.07,33.27 60.45,32.89 64.52,32.89 66.55,30.86 72.52,30.86 v72.64,30.99
5VIO-1  (via drill 0.51)
  Top 0.254: R11.1 67.56,30.99 67.24,30.67 D5.6 67.24,29.15 v67.82,28.57 | MCU.17 36.11,41.87 38.1,39.88 v38.61,39.88 | v46.99,39.88 46.99,38.1 49.78,35.31 58.17,35.31 59.18,34.29 v59.18,32.64
  Bottom 0.254: v38.61,39.88 38.86,39.88 39.5,40.51 45.34,40.51 45.97,39.88 v46.99,39.88 | v59.18,32.64 59.56,32.26 64.14,32.26 v67.82,28.57
5VIO-2  (via drill 0.51)
  Top 0.254: R12.1 65.02,30.99 65.34,30.67 D5.4 65.34,29.02 v64.9,28.57 | MCU.18 36.77,42.1 37.85,41.02 v38.61,41.02 | v58.29,33.27 58.29,34.29 57.78,34.8 49.53,34.8 46.23,38.1 v46.23,41.02
  Bottom 0.254: 58.29,32.89 v58.29,33.27 58.29,32.26 58.93,31.62 64.01,31.62 64.9,30.73 v64.9,28.57 | v38.61,41.02 v46.23,41.02
5VIO-3  (via drill 0.51)
  Top 0.254: R13.1 61.72,31.11 | D5.3 65.25,32.64 62.48,32.64 61.72,31.88 61.72,31.11 | v45.34,42.16 45.34,40.77 45.59,40.51 45.59,37.97 49.28,34.29 57.02,34.29 57.53,33.78 57.53,32.64 59.05,31.11 61.72,31.11 | v38.61,42.16 37.72,42.16 37.4,42.48 MCU.19
  Bottom 0.254: v38.61,42.16 38.99,42.16 39.62,41.53 44.7,41.53 v45.34,42.16
+3V3  (via drill 0.51)
  Top 0.254: C14.1 15.75,16.99 | U1.4 16.26,42.93 | 30.23,52.31 MCU.31 30.26,50.84 v30.35,50.8 | MCU.1 25.72,46.67 v25.65,46.74 | v17.65,46.74 16.38,46.74 U2.8 16.38,48.64 16.76,49.02 C3.2 20.95,49.02 | U2.1.2 36.73,14.06 36.32,14.48 35.43,14.48 34.92,13.97 R6.2 C15.2 32.51,14.1 v31.11,14.1 | D1.5 v64.01,18.03 | v71.37,20.95 D3.5 | H3.1.3 70.55,7.18 69.22,8.51 69.22,11.43 68.96,11.68 68.96,15.75 v66.67,18.03 | H9.1.2 20.95,72.64 20.7,72.9 20.7,74.42 19.81,75.31 19.05,75.31 17.91,74.17 R9.2
  Top 0.406: 16.26,23.88 U1.2 16.26,18.8 C13.1 15.75,16.99 | 16.26,23.88 U1.4 | D2.1 15.8,16.01 C14.1 | R4.1 R5.1 v29.84,20.83 23.11,20.83 23.11,23.88 16.26,23.88 | v61.21,18.03 59.18,18.03 59.18,16.64 55.88,16.64 55.88,8.64 D4.5 52.32,8.64 45.34,15.62 38.61,15.62 38.61,16.64 v33.4,16.64 | v57.66,47.37 54.1,47.37 49.78,43.05 45.85,43.05 44.58,44.32 v44.58,49.28
  Top 1.27: 20.95,49.02 H9.1.2
  Bottom 0.254: v71.37,20.95 68.45,18.03 v66.67,18.03 v64.01,18.03 v61.21,18.03 | v29.84,20.83 31.11,20.83 33.4,18.54 v33.4,16.64 33.4,15.49 32,14.1 v31.11,14.1 | 62.35,48.74 U8.2.1 | 57.78,47.5 v57.66,47.37 | v44.58,49.28 44.2,49.28
  Bottom 0.406: C30.2 60.25,47.67 60.07,47.5 57.78,47.5 | 44.2,49.28 41.4,52.07 39.75,52.07 38.35,53.47 32.13,53.47 30.35,51.69 v30.35,50.8 29.72,50.8 | C17.1 26.16,50.8 29.72,50.8 | C18.1 29.72,50.8
  Bottom 0.61: C17.1 C5.1.1 26.16,47.24 v25.65,46.74 v17.65,46.74 | C30.2 62.35,48.74
  pour Top (isolate 0.406, rank 2): 20.32,66.55 27.43,66.55 27.43,42.16 19.05,42.16 19.05,26.92 33.53,26.92 33.53,14.73 27.94,14.73 27.94,9.14 22.61,9.14 22.61,15.24 14.99,15.24 14.99,22.35 13.21,22.35 13.21,30.23 14.99,30.23 14.99,49.53 20.32,49.53
+5V  (via drill 0.51)
  Top 0.254: LED1.A | 26.75,7.62 H2.1.2 | 18.8,8.68 C4.1 | D2.3 18.57,18.21 | 11.3,24.13 C7.1 v12.95,24.13 | C21.2 35.05,17.78 35.05,17.4 36.07,17.4 | 36.07,17.4 38.03,17.4 U2.1.21 | 36.07,17.4 U2.1.24 35.31,18.74 v35.31,18.67 | R8.2 v47.24,6.86 | D5.5 v66.29,28.57 | MCU.21 36.77,53.28 37.08,53.59 37.59,53.59 38.1,54.1 C20.1 v40.39,54.61 | 52.83,27.43 U6.1.8 50.29,27.43 v49.78,26.92 | U6.2.8 v49.66,31.24
  Top 0.406: 26.75,7.62 R7.1 23.16,6.65 LED1.A | LED1.A 18.8,8.68 | U4.5 11.91,64.29 C22.1 13.21,62.99 13.21,60.71 12.77,60.26 U3.5 11.91,59.21 C16.1 | 18.57,18.21 U1.3 | D2.3 21.59,18.21 21.59,12.19 P1.2
  Top 0.61: v10.41,60.2 10.48,60.26 U3.5
  Bottom 0.254: P1.2 16.51,12.19 | 6.99,28.7 CN1.13 | 26.8,5.21 26.92,5.08 | v35.31,18.67 51.05,18.67 51.05,18.54 | v47.24,6.86 47.24,5.08 | 60.45,24.51 60.58,24.38 | H6.1.8 63.75,25.65 65.79,25.65 66.29,26.16 v66.29,28.57 | v49.66,31.24 50.93,31.24 51.05,31.11 | v49.78,26.92 51.05,26.92 | 62.35,63.75 U9.2.8 | v12.95,24.13 16.38,24.13 16.51,24.26 | v40.39,54.61 50.67,54.61 51.05,54.23
  Bottom 0.406: 51.18,37.59 51.05,37.72
  Bottom 0.61: C32.2 62.87,40.64 U6.4.8 60.05,40.37 57.28,37.59 51.18,37.59 | C25.1 L2.2 | L3.2 C26.1 | C24.1 L1.2 53.85,66.42 54.48,67.06 61.59,67.06 62.4,66.25 U9.2.8 | C31.2 58.55,62.99 59.31,63.75 62.35,63.75 | CN1.5 9.4,51.18 10.41,52.2 v10.41,60.2
  Bottom 1.27: CN1.13 CN1.12 CN1.11 CN1.10 CN1.9 CN1.8 CN1.7 CN1.6 CN1.5 | 6.99,28.7 16.51,28.7 16.51,24.26 16.51,12.19 16.51,5.08 26.92,5.08 47.24,5.08 51.05,5.08 51.05,18.54 51.05,24.38 | 51.05,24.38 51.05,26.92 51.05,31.11 51.05,37.72 51.05,42.93 | 51.05,42.93 51.05,54.23 51.05,54.86 | 51.05,54.86 51.05,65.28 | 51.05,65.28 51.05,73.66 H8.1.1 | L1.2 51.05,65.28 | L3.2 51.05,54.86 | L2.2 51.05,42.93 | H6.1.8 60.58,24.38 51.05,24.38 | H2.1.2 26.8,5.21
  pour Bottom (isolate 0.406, rank 3): 0,60.71 18.29,60.71 18.03,31.5 23.88,25.4 48.26,25.4 48.26,49.28 39.37,49.28 39.37,74.93 63.5,74.93 63.5,63.5 57.15,63.5 57.15,62.23 55.37,62.23 55.37,40.64 63.5,40.64 63.5,37.85 60.45,37.85 60.45,25.65 63.75,25.65 63.75,0 0,0
CONTRAST
  Top 0.305: VR1.2 29.57,10.44 H2.1.3
DB0
  Top 0.254: U2.1.4 38.03,12.23 37.27,11.48 36.64,11.48 35.37,10.21 H2.1.7
DB1  (via drill 0.51)
  Top 0.254: U2.1.5 38.69,14.64 v38.7,14.65
  Bottom 0.254: H2.1.8 35.37,7.67 35.69,7.98 35.69,11.64 v38.7,14.65
DB2
  Top 0.254: U2.1.6 39.33,11.62 37.91,10.21 H2.1.9
DB3  (via drill 0.51)
  Top 0.254: U2.1.7 39.99,14.64 v39.97,14.65
  Bottom 0.254: H2.1.10 37.91,7.67 38.23,7.98 38.23,12.91 v39.97,14.65
DB4
  Top 0.254: H2.1.11 40.62,11.33 U2.1.8
DB5  (via drill 0.51)
  Top 0.254: U2.1.9 41.28,14.61 v41.24,14.65
  Bottom 0.254: H2.1.12 39.81,7.67 40.77,8.62 40.77,14.18 v41.24,14.65
DB6
  Top 0.254: U2.1.10 41.94,10.3 H2.1.13
DB7  (via drill 0.51)
  Top 0.254: U2.1.11 42.58,14.59 v42.51,14.65
  Bottom 0.254: H2.1.14 42.99,7.67 43.31,7.98 43.31,13.86 v42.51,14.65
ENABLE  (via drill 0.51)
  Top 0.305: U2.1.14 42.58,17.41 v42.35,17.19
  Bottom 0.305: v42.35,17.19 42.35,16.56 41.4,15.6 37.91,15.6 33.15,10.84 33.15,7.98 32.83,7.67 H2.1.6
EXT_SRC-A
  Top 0.254: U6.2.6 44.45,32.26 43.05,33.66 43.05,46.48 39.37,50.16 35.31,50.16 34.8,50.67 34.8,52.33 MCU.24
EXT_SRC-B
  Top 0.254: MCU.23 35.47,51.02 35.81,50.67 39.62,50.67 43.56,46.74 43.56,33.91 44.7,32.77 U6.2.5
EXT_TTL
  Top 0.254: H6.1.2 70.1,24.13 68.96,22.99 60.71,22.99 59.82,23.88 59.82,25.4 57.28,27.94 U6.1.2 54.1,27.94 53.98,28.07 53.98,29.34 54.1,29.46 55.63,29.46 56.01,29.84 56.01,31.5 55.75,31.75 U6.2.2
GND  (via drill 0.51)
  Top 0.254: 60.74,54.97 U8.1.2 | R1.1 13.91,8.38 | 13.27,67.24 13.21,67.31 | 12.57,54.74 R3.2 | C3.1 12.95,50.55 12.57,50.93 U2.4 | C2.2 26.67,31.75 | 26.67,31.75 C1.2 | 26.67,31.75 v26.67,30.23 | C14.2 14.22,16.99 | C7.2 13.95,22.61 U1.1 | 24.38,10.21 24.38,14.95 VR1.1 27.04,15.75 32.26,15.75 C15.1 C21.1 | C4.2 17.32,10.21 24.38,10.21 | H2.1.1 24.38,10.21 | D4.2 58.91,8.64 H3.1.11 | 60.39,3.87 60.33,3.81 | 78.11,13.97 78.23,14.1 | C11.2 64.01,13.97 | 64.01,13.97 C10.2 | D1.2 v64.01,15.24 64.01,13.97 | C12.2 v58.93,13.97 | D3.2 v71.37,15.37 71.37,13.97 C8.2 C6.2 | 68.01,4.13 68.33,3.81 | D5.2 66.29,36.2 | v52.58,51.31 50.93,52.96 R19.1 47.75,52.2 47.75,45.72 48.51,44.96 R16.1 | U6.2.4 56.13,32.77 56.9,32 v56.9,30.1 56.9,29.34 56.52,28.96 U6.1.4 | v60.61,36.56 60.61,36.99 60.71,37.08 | JP1.9 29.57,76.47 30.86,75.18 | 30.86,75.18 36.83,75.18 R15.1 39.37,77.72 43.94,77.72 R18.1 44.96,74.17 H8.1.2 45.47,72.01 45.85,71.63 53.47,71.63 54.99,73.15 57.91,73.15 58.67,72.39 R17.2 58.67,67.56 U9.1.2 | 60.45,45.21 60.71,45.47 | MCU.30 30.9,54.74 | 30.9,54.74 30.9,75.15 30.86,75.18 | 30.9,54.74 31.03,54.61 C20.2 36.11,54.14 MCU.22 36.11,51.4 36.32,51.18 38.23,51.18 v38.86,51.69 | MCU.4 27.65,46.57 v27.43,46.74 | 44.58,3.94 44.45,3.81 | C16.2 18.29,58.67 18.29,58.55 | C9.2 v67.82,15.49
  Top 0.406: 13.91,8.38 10.92,8.38 | C4.2 14.34,8.73 R1.1 | 13.21,69.34 CN1.G2 | U4.3 13.27,67.24 | U2.4 12.57,54.74 | 14.22,16.99 C13.2 13.95,18.8 U1.1 | 10.92,16.26 14.27,16.26 C14.2 | H3.1.11 60.39,3.87 | C5.2 v76.71,13.97 78.11,13.97 | H3.1.5 68.01,4.13 | 13.21,69.34 13.21,67.31 13.21,65.02 13.97,64.26 C22.2 13.97,63.25 14.51,62.71 U3.3 18.29,62.16 18.29,58.55 C3.1 | 13.21,69.34 13.21,73.03 14.22,74.04 15.37,74.04 C23.2 | U2.1.12 43.24,9.01 H2.1.16 44.58,3.94
  Top 1.27: 60.74,54.97 U9.1.2 | U8.1.2 60.71,45.47 U6.3.2 60.71,37.08 60.71,36.2 66.29,36.2 75.69,36.2 78.23,33.66 v78.23,22.61 78.23,14.1 78.23,3.81 68.33,3.81 60.33,3.81 44.45,3.81 10.92,3.81 10.92,8.38 P1.1 10.92,16.26 6.1,16.26 CN1.G1 6.1,25.4 4.7,25.4 CN1.25 CN1.24 CN1.23 CN1.22 CN1.21 CN1.20 CN1.19 CN1.18 CN1.17 1.91,52.58 1.91,69.34 CN1.G2
  Bottom 0.254: v26.67,30.23 26.67,45.47 27.43,46.23 v27.43,46.74 | 71.37,14.1 71.25,13.97 | U6.3.2 60.71,43.05 | 62.74,43.69 C32.1 | v56.9,30.1 56.9,32.13 57.53,32.77 57.53,35.31 58.78,36.56 v60.61,36.56 U6.4.5 | 27.43,47.75 C5.1.2
  Bottom 0.406: H6.1.6 65.02,22.61 v78.23,22.61
  Bottom 0.61: C17.2 C5.1.2 C18.2 C19.2 33.53,48.01 37.21,51.69 v38.86,51.69 | v64.01,15.24 64.01,13.97 | 64.01,13.97 C9.2 | C9.2 71.25,13.97 v76.71,13.97 | v58.93,13.97 64.01,13.97 | v71.37,15.37 71.37,14.1 | 60.71,43.05 61.34,43.69 62.74,43.69 | C25.2 C28.2 57.15,39.37 U6.3.2 | C24.2 C27.2 C31.1 57.66,60.58 58.34,59.9 60.83,59.9 | U8.2.4 60.75,52.53 | 60.75,52.53 60.71,52.58 U8.1.2 60.71,59.77 60.83,59.9 | v52.58,51.31 C26.2 C29.2 57.15,51.31 58.37,52.53 60.75,52.53 | C30.1 56.67,48.74 55.88,49.53 55.88,50.55 | U9.2.5 60.83,59.9 | v27.43,46.74 27.43,47.75 | v67.82,15.49 C9.2
  Bottom 0.635: C29.2 55.88,50.55
  other vias: 10.16,1.52 13.97,1.52 18.03,1.52 21.84,1.52 25.91,1.52 29.72,1.52 33.78,1.52 37.59,1.52 41.66,1.52 45.47,1.52 49.53,1.52 53.34,1.52 57.4,1.52 61.21,1.52 65.28,1.52 69.09,1.52 73.15,1.52 76.96,1.52 86.87,11.68 86.87,15.49 86.87,19.56 86.87,23.37 86.87,27.43 60.2,79.5 56.13,79.5 52.32,79.5 48.01,79.5 34.8,79.5 30.73,79.5 26.67,79.5 22.61,79.5 18.8,79.5 14.73,79.5 10.92,79.5
  pour Top (isolate 0.406, rank 3): 0,81.28 61.98,81.28 61.98,37.08 76.45,37.08 79.25,34.54 88.65,34.54 88.65,0 0,0
  pour Bottom (isolate 0.406, rank 2): 63.5,60.96 58.93,60.96 58.93,61.72 53.34,61.72 53.34,60.45 55.88,60.45 55.88,52.32 51.56,52.32 51.56,50.29 56.64,50.29 56.64,40.13 53.34,40.13 53.34,38.86 56.9,38.86 60.96,42.93 63.5,42.93
  pour Bottom (isolate 0.61, rank 2): 12.45,-0.25 0,-0.25 0,81.79 10.16,81.79 10.16,61.21 5.08,61.21 5.08,25.65 10.41,25.65 10.41,15.75 12.45,15.75
LASER_CURRENT
  Top 0.406: CN1.2 8.26,59.56 11.43,56.39 R2.2
LASER_CURRENT_3V  (via drill 0.51)
  Top 0.254: U2.2 U2.1 16.45,52.45 v17.4,52.45 | MCU.8 30.26,47.21 28.83,48.64 23.37,48.64 20.07,45.34 v16.13,45.34
  Bottom 0.254: v16.13,45.34 16.13,51.18 v17.4,52.45
LASER_ILK  (via drill 0.51)
  Top 0.254: U3.2 15.62,61.21 v15.75,61.34 | MCU.20 38.14,53.09 v40.13,53.09 43.94,53.09 49.78,58.93 R14.2
  Bottom 0.254: v15.75,61.34 14.99,60.58 14.99,55.12 16.38,53.72 26.42,53.72 26.8,54.1 39.12,54.1 v40.13,53.09
LASER_ILK_HIGH  (via drill 0.51)
  Top 0.254: v59.18,61.09 59.18,60.58 57.53,58.93 R14.1
  Bottom 0.254: U9.2.6 59.36,61.17 v59.18,61.09
LASER_SRC-A
  Top 0.254: U6.1.6 46.74,28.45 42.04,33.15 42.04,45.97 38.86,49.15 34.16,49.15 33.52,49.8 MCU.26
LASER_SRC-B
  Top 0.254: MCU.25 34.15,50.05 34.54,49.66 39.12,49.66 42.55,46.23 42.55,33.4 46.99,28.96 U6.1.5
LASER_TEMPERATURE
  Top 0.406: CN1.3 8.76,56.77 10.16,55.37 10.16,51.56 12.57,49.15 U2.5
LASER_TEMPERATURE_3V
  Top 0.254: U2.6 U2.7 15.11,44.83 15.49,44.45 20.07,44.45 23.62,48.01 27.94,48.01 28.31,47.64 MCU.5
LASER_TTL  (via drill 0.51)
  Top 0.254: U6.1.7 49.15,27.94 v48.77,27.56 | v16,66.29 U4.2
  Bottom 0.254: v48.77,27.56 48.77,25.78 47.88,24.89 23.88,24.89 14.35,34.42 14.35,64.64 v16,66.29
MCU_TTL1  (via drill 0.51)
  Top 0.254: MCU.28 32.22,49.44 33.53,48.13 38.23,48.13 41.02,45.34 41.02,32.64 48.01,25.65 52.58,25.65 54.36,27.43 U6.1.1 56.26,27.43 56.64,27.05 v56.64,26.8 | U6.2.3 54.1,32.26 53.59,31.75 53.59,30.35 53.34,30.1 v52.58,30.1
  Bottom 0.254: v52.58,30.1 54.48,30.1 54.99,29.59 54.99,28.45 v56.64,26.8
MCU_TTL2
  Top 0.254: MCU.27 32.85,49.7 33.91,48.64 38.48,48.64 41.53,45.59 41.53,32.89 48.26,26.16 52.2,26.16 53.47,27.43 53.47,29.46 54.1,30.1 54.1,31.11 54.23,31.24 U6.2.1
N$1
  Top 0.254: U8.3.4 85.07,51.8 C36.1
N$2
  Top 0.254: U8.3.5 84.82,53.07 C36.2
N$3
  Top 0.254: U8.3.3 84.34,50.53 C35.1
N$4
  Top 0.254: U8.3.1 84.82,47.99 C35.2
N$5
  Top 0.254: U8.3.6 84.06,54.34 C39.2
N$6
  Top 0.254: C38.2 81.03,48.9 81.41,49.28 82.61,49.28 U8.3.2
N$8  (via drill 0.51)
  Top 0.254: v59.31,62.48 59.31,62.61 59.44,62.74 59.44,66.17 57.4,68.2 57.4,71.13 LED9.1.A
  Bottom 0.254: U9.2.7 59.36,62.44 v59.31,62.48
N$9
  Bottom 0.61: C27.1 L1.1 57.91,65.28 U9.1.1
N$10
  Top 0.254: 11.84,67.31 U4.4
  Top 0.406: CN1.14 4.7,63.37 8.64,67.31 11.84,67.31
N$11
  Bottom 0.254: U6.4.3 81.15,37.83 H6.2.2
N$12
  Top 0.254: 11.84,62.23 U3.4
  Top 0.406: CN1.1 7.62,62.23 11.84,62.23
N$13
  Top 0.254: H9.1.1 23.5,70.61 21.97,72.14 21.97,73.96 JP1.4
N$14
  Bottom 0.61: R20.2 74.8,61.21 76.45,62.87 81.53,62.87 82.04,63.37 H9.2.2
N$15
  Top 0.254: U2.1.3 37.37,14.95 36.83,15.49 R6.1
N$16
  Top 0.254: JP1.2 19.41,72.12 18.41,71.12 H9.1.3
N$17
  Top 0.254: R10.2 71.12,27.94 H6.1.1
N$18
  Top 0.406: R2.1 R3.1 13.84,54.74 U2.3
N$19
  Bottom 0.254: 70.06,61.17 R20.1
  Bottom 0.61: U9.2.2 U9.2.3 70.06,61.17
N$20
  Top 0.254: LED1.C 15.95,6.78
  Top 0.406: 15.95,6.78 R1.2
N$21
  Top 0.254: MCU.2 26.35,37.53 25.91,37.08 Y1.2 24.38,36.96 24.38,35.81 25.65,34.54 C1.1
N$22
  Top 0.254: MCU.3 27.01,37.5 27.43,37.08 Y1.1 28.96,36.96 28.96,36.07 27.43,34.54 C2.1
N$23
  Top 0.254: R16.2 46.99,45.09 46.35,45.72 46.35,47.22 LED8.2.C
N$24  (via drill 0.51)
  Top 0.254: MCU.29 31.56,50.86 v31.5,50.8
  Bottom 0.254: C19.1 32,50.29 v31.5,50.8
N$25
  Top 0.254: LED8.4.C 46.33,52.3 R19.2
N$26
  Top 0.254: R15.2 38.35,78.99 38.73,79.38 40.16,79.38 LED8.1.C
N$27
  Top 0.61: U9.1.4 73.41,66.55 74.3,67.44 83.82,67.44 84.58,66.67 H9.2.1
  Bottom 0.61: U9.1.4 C34.2 71.63,64.77 70.56,63.71 U9.2.1
N$28  (via drill 0.51)
  Top 0.61: v69.72,59.31 69.72,64.14 U9.1.3
  Bottom 0.61: H9.2.3 77.22,67.31 69.34,67.31 68.33,66.29 U9.1.3 C34.1 | U9.2.4 69.14,59.9 v69.72,59.31
N$29
  Top 0.254: R18.2 44.96,78.74 44.32,79.38 43.16,79.38 LED8.3.C
N$30
  Top 0.254: R17.1 60.2,71.13 LED9.1.C
N$31
  Top 0.254: R11.2 69.09,28.45 H6.1.3
N$32
  Bottom 0.61: C28.1 L2.1 U6.3.1
N$33
  Bottom 0.61: C29.1 L3.1 U8.1.1
N$34
  Top 0.254: R12.2 63.5,28.45 H6.1.5
N$35
  Top 0.254: R13.2 61.72,27.69 H6.1.7
N$39
  Top 0.254: VR1.3 27.43,12.95 28.07,12.32 28.07,9.4 27.69,9.02 25.15,9.02 24.89,9.27 24.26,9.27 R7.2
N$41
  Top 0.254: R8.1 44.88,9.91 H2.1.15
R/W  (via drill 0.51)
  Top 0.305: U2.1.15 41.94,17.89 v41.24,17.19
  Bottom 0.305: v41.24,17.19 41.24,16.4 41.08,16.24 37.27,16.24 31.88,10.84 H2.1.5
RS  (via drill 0.51)
  Top 0.305: U2.1.13 43.24,16.8 42.67,16.24 40.45,16.24 39.97,16.72 v39.97,17.19
  Bottom 0.305: 36.64,17.19 30.61,11.16 30.61,7.98 30.29,7.67 H2.1.4
  Bottom 0.406: v39.97,17.19 36.64,17.19
RS232_RX
  Top 0.254: U8.3.13 79.49,51.8 80.01,52.32 80.01,57.4 79.5,57.91 H8.2.3
RS232_TX
  Top 0.254: U8.3.14 80.25,50.53 80.77,51.05 80.77,57.4 82.04,58.67 H8.2.2
RST
  Top 0.254: C23.1 R9.1 18.59,75.69 JP1.1 20.62,75.31 22.48,75.31 23.24,74.55 23.24,72.26 27.01,68.49 MCU.36
RX1  (via drill 0.51)
  Top 0.254: v57.4,50.04 51.56,50.04 50.55,51.05 LED8.4.A 49.28,50.95 v49.28,49.4 | v29.46,46.74 29.6,46.62 MCU.7
  Bottom 0.254: U8.2.2 57.71,49.99 v57.4,50.04 | v49.28,49.4 45.85,45.97 30.23,45.97 v29.46,46.74
RX2  (via drill 0.51)
  Top 0.254: MCU.38 25.72,53.78 24.89,54.61 v24.89,55.75 | LED8.1.A H8.1.4
  Bottom 0.254: H8.1.4 40.39,56.77 38.99,55.37 26.8,55.37 26.42,55.75 v24.89,55.75
SCL  (via drill 0.51)
  Top 0.254: U2.1.22 37.37,20.8 37.34,20.95 | 54.52,9.53 D4.4 54.61,9.62 v54.61,10.67 54.61,11.3 44.96,20.95 37.34,20.95 | 37.34,20.95 34.16,20.95 | 34.16,20.95 R5.2 | 34.16,20.95 34.16,38.48 31.56,41.08 MCU.10
  Bottom 0.254: H3.1.7 64.12,8.51 59.82,8.51 58.8,9.53 55.75,9.53 v54.61,10.67
SDA  (via drill 0.51)
  Top 0.254: U2.1.23 36.73,19.91 36.45,20.19 35.69,20.19 v35.31,19.81 34.8,19.3 R4.2 | H3.1.9 62.93,7.18 61.59,8.51 59.82,8.51 58.74,9.59 D4.3 57.18,10.64 v57.15,10.67 | v53.21,10.67 53.21,11.94 44.96,20.19 v38.23,20.19 | MCU.9 30.9,40.98 33.53,38.35 33.53,22.86 v33.02,22.35
  Bottom 0.254: v57.15,10.67 56.39,10.67 55.5,11.56 54.1,11.56 v53.21,10.67 | v38.23,20.19 35.69,20.19 v35.31,19.81 33.53,19.81 33.02,20.32 v33.02,22.35
SERIAL_RX  (via drill 0.51)
  Top 0.254: v69.72,50.04 72.9,50.04 75.95,53.09 77.89,53.09 U8.3.12
  Bottom 0.254: U8.2.7 69.67,49.99 v69.72,50.04
SERIAL_TX  (via drill 0.51)
  Top 0.254: U8.3.11 76.06,54.34 73.03,51.31 v69.72,51.31
  Bottom 0.254: U8.2.6 69.67,51.26 v69.72,51.31
SGND  (via drill 0.51)
  Top 0.254: U8.3.15 77.92,49.28 79.25,49.28 79.5,49.02 C38.1 C33.2 | 77.89,49.28 U8.3.15 | H8.2.1 84.58,58.42 85.09,57.91 C39.1 | U8.3.15 75.96,49.26 v75.95,49.28
  Bottom 0.61: U8.1.3 C40.2 | U8.1.3 68.33,56.13 68.83,56.64 75.95,56.64 | 75.95,56.64 83.82,56.64 84.58,57.4 H8.2.1 | U8.1.3 68.33,54.36 67.3,53.33 U8.2.5 | v75.95,49.28 75.95,56.64
STAR
  Top 0.254: 40.18,62.83 40.18,64.42 | 40.18,62.83 41.77,62.83 | 40.18,62.83 40.18,61.25 | 40.18,62.83 38.59,62.83 | 40.18,62.83 41.37,64.03 | 40.18,62.83 38.99,64.03 | 40.18,62.83 38.99,61.64 | 40.18,62.83 41.37,61.64 | 40.18,62.83 40.66,63.94 | 40.18,62.83 39.7,63.94 | 40.18,62.83 39.07,63.31 | 40.18,62.83 39.07,62.36 | 40.18,62.83 39.7,61.72 | 40.18,62.83 40.66,61.72 | 40.18,62.83 41.29,63.31 | 40.18,62.83 41.29,62.36
TEST
  Top 0.254: JP1.7 26.99,76.52 25.65,75.18 25.65,70.61 27.65,68.62 MCU.35
TTL_GND_ISO
  Bottom 0.61: U6.4.4 83.61,36.56 84.39,37.34 H6.2.1 H6.2.3 84.39,43.62 83.19,44.83 69.34,44.83 68.33,43.81 U6.3.3 C37.1
TTL_IN  (via drill 0.51)
  Top 0.254: U6.1.3 57.66,28.45 | 57.66,28.45 60.58,25.53 66.42,25.53 H6.1.4 | MCU.16 35.47,41.74 v38.61,38.61 | 57.66,28.45 57.66,31.88 56.9,32.64 56.9,33.02 v56.64,33.27 56.13,33.78 45.59,33.78 44.58,34.8 44.58,38.35 v44.83,38.61
  Bottom 0.254: U6.4.6 59.29,37.83 56.64,35.18 v56.64,33.27 | v38.61,38.61 39.12,38.1 44.32,38.1 v44.83,38.61
TTL_ISO_VCC
  Bottom 0.61: U6.4.1 72.25,40.37 73.41,41.53 U6.3.4 C37.2
TTL_OUT  (via drill 0.51)
  Top 0.254: U6.2.7 52.96,31.75 53.21,32 53.21,32.51 v53.59,32.89
  Bottom 0.254: U6.4.7 62.58,39.12 59.82,39.12 v53.59,32.89
TTL_OUT_ISO
  Bottom 0.254: U6.4.2 79.88,39.1 H6.2.4
TX1  (via drill 0.51)
  Top 0.254: v58.93,51.31 58.93,49.78 58.42,49.28 51.44,49.28 50.42,48.26 v49.28,48.26 49.28,47.26 49.26,47.25 | MCU.6 28.96,45.02 v28.96,43.43 | 49.28,47.35 49.26,47.25 | 49.26,47.25 LED8.2.A
  Bottom 0.254: U8.2.3 58.98,51.26 v58.93,51.31 | v28.96,43.43 28.96,44.45 29.97,45.47 46.48,45.47 v49.28,48.26
TX2  (via drill 0.51)
  Top 0.254: MCU.37 26.35,54.42 v26.04,54.74 | LED8.3.A H8.1.3
  Bottom 0.254: v26.04,54.74 39.12,54.74 40.89,56.52 40.89,69.98 42.93,72.01 H8.1.3
VBUS  (via drill 0.51)
  Top 0.254: U8.3.16 75.96,47.99 v75.95,48.01 75.9,47.96 C33.1
  Bottom 0.61: U8.2.8 69.34,48.72 70.06,48.01 73.41,48.01 | 73.41,48.01 U8.1.4 C40.1 | v75.95,48.01 73.41,48.01
(copper drawn outside any net)
  shapes: Top circle x3

### Text on the board
bStop: github.com/mjbeals/Laser_controller | 2013 Matthew Beals
_tsilk: BLUE TOOTH UART | INTERLOCK | TX | ENABLE | ICSP | RX | GND | 5V | V+ | ITL | GND | GND | TEST | PWR | RX | TX | LOCAL | GND | RST | TOOL | RS232 | RX | TX | OUT | IN | Analog | EXPANSION | OUT | IN | GND | +5V | EXTERNAL TRIGGER | 5V GPIO | 2.2 | 2.1 | 2.0 | 1.6 | 1.6 | 3.1 | 3.2 | 1.3 | 1.2 | 1.1 | 1.0 | GND | GPIO | +5V | GND | CONT | R/W | LED+ | LED- | RS | +5V | GND | SDA | SCL | GND | +3V | 0 | 2 | 4 | 6 | Power | ENABLE | 1 | 3 | 5 | 7 | DB | I2C | POWER | LCD | FRONT PANEL
_bsilk: INTERLOCK | ENABLE | V+ | ITL | GND | ICSP | RX | TX | GND | 5V | BLUE TOOTH UART | GND | TEST | PWR | GND | TX | RX | LOCAL | RST | TOOL | RS232 | OUT | IN | Analog | MCU | EXPANSION | Laser Temperature | Laser Current | OUT | IN | GND | +5V | EXTERNAL TRIGGER | 5V GPIO | 2.2 | 2.1 | 2.0 | 1.6 | +5V | GND | GND | CONT | R/W | 0 | 2 | 4 | 6 | GPIO | 1.6 | 3.1 | 3.2 | 1.3 | 1.2 | 1.1 | LED+ | LED- | GND | SDA | SCL | GND | +3V | 1.0 | RS | 1 | 3 | 5 | 7 | +5V | ENABLE | DB | I2C | POWER | FRONT PANEL | LCD